# Altium project zx_revo_a3.PrjPcb (part 1 of 3)
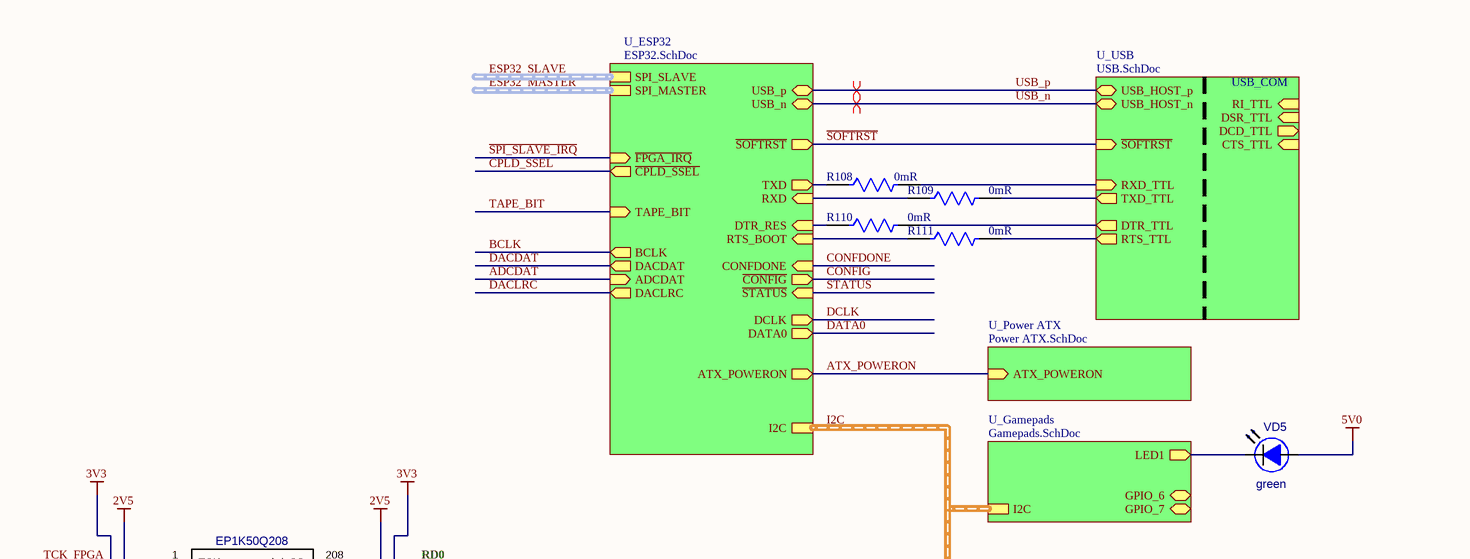
[diagram p0: FPGA.SchDoc, top]
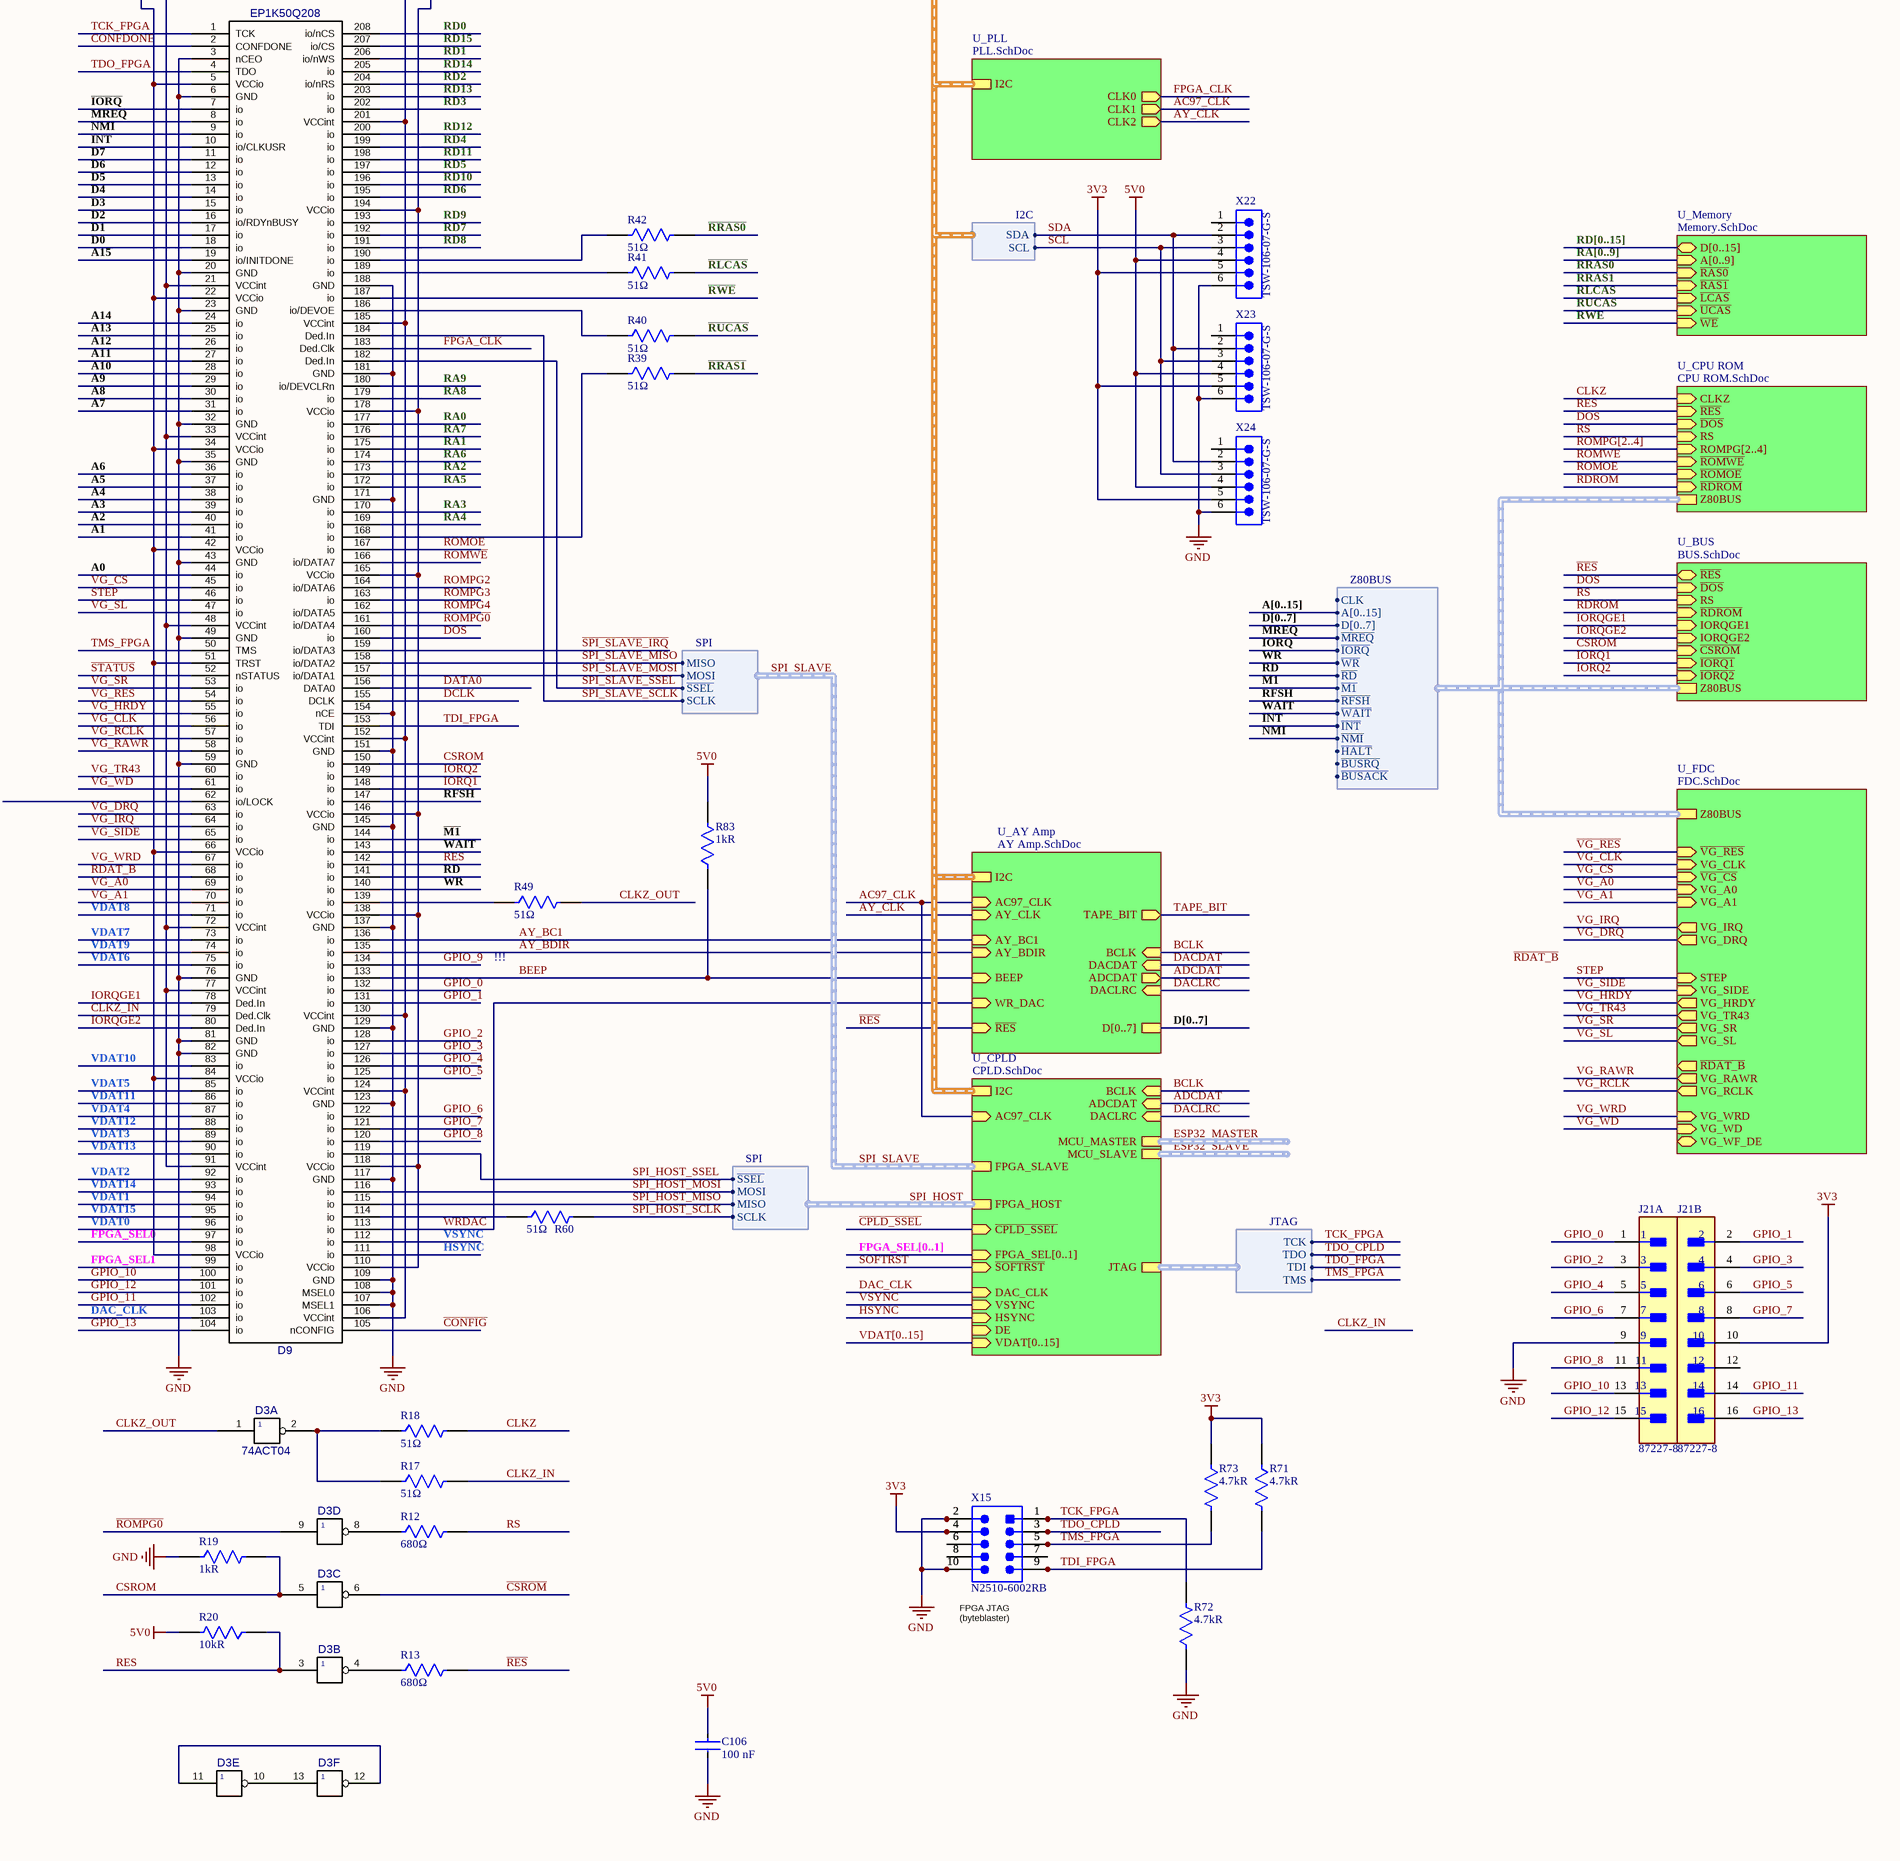
[diagram p1: FPGA.SchDoc, bottom]
13 sheets, 288 parts. Net scope: hierarchical (ports join the sheet entries above them; power ports are global).
Board file: RevA3.PcbDoc
Sheets:
  FPGA.SchDoc
    U_CPU ROM = CPU ROM.SchDoc
    U_BUS = BUS.SchDoc
    U_FDC = FDC.SchDoc
    U_CPLD = CPLD.SchDoc
      U_Video out = Video out.SchDoc
      U_SDCARD = SDCARD.SchDoc
    U_Power ATX = Power ATX.SchDoc
    U_USB = USB.SchDoc
    U_ESP32 = ESP32.SchDoc
    U_AY Amp = AY Amp.SchDoc
      U_Tape = Tape.SchDoc
    U_Gamepads = Gamepads.SchDoc

## Sheet FPGA.SchDoc
size A2 portrait; SheetNumber: 1; SheetTotal: 15

### Parts
C106  Capacitance: 100 nF  [FP-CC0805-0_85-IPC_A]  (hidden comment: CC0805KRX7R9BB104)
D3  value 74ACT04  [SO14]  (hidden comment: 04)  (parts A,B,C,D,E,F of 6)
D9  EP1K50Q208  [PQFP208X5]
J21  87227-8  [FP-87227-8-MFG]  (parts A,B of 2)
R12  value 680Ω  [FP-RT0805-IPC_A]  (hidden comment: RT0805FRE07680RL)
R13  value 680Ω  [FP-RT0805-IPC_A]  (hidden comment: RT0805FRE07680RL)
R17  Resistance: 51Ω  [FP-RR1220-IPC_A]  (hidden comment: RR1220Q-510-D)
R18  Resistance: 51Ω  [FP-RR1220-IPC_A]  (hidden comment: RR1220Q-510-D)
R19  Resistance: 1kR  [FP-CRCW0805-HPe3-IPC_A]  (hidden comment: CRCW08051K00FKEAHP)
R20  Resistance: 10kR  [FP-CR0805-IPC_A]  (hidden comment: CR0805-JW-103ELF)
R39  Resistance: 51Ω  [FP-RR1220-IPC_A]  (hidden comment: RR1220Q-510-D)
R40  Resistance: 51Ω  [FP-RR1220-IPC_A]  (hidden comment: RR1220Q-510-D)
R41  Resistance: 51Ω  [FP-RR1220-IPC_A]  (hidden comment: RR1220Q-510-D)
R42  Resistance: 51Ω  [FP-RR1220-IPC_A]  (hidden comment: RR1220Q-510-D)
R49  Resistance: 51Ω  [FP-RR1220-IPC_A]  (hidden comment: RR1220Q-510-D)
R60  Resistance: 51Ω  [FP-RR1220-IPC_A]  (hidden comment: RR1220Q-510-D)
R71  Resistance: 4.7kR  [FP-CR0805-IPC_A]  (hidden comment: CR0805-JW-472ELF)
R72  Resistance: 4.7kR  [FP-CR0805-IPC_A]  (hidden comment: CR0805-JW-472ELF)
R73  Resistance: 4.7kR  [FP-CR0805-IPC_A]  (hidden comment: CR0805-JW-472ELF)
R83  Resistance: 1kR  [FP-CRCW0805-HPe3-IPC_A]  (hidden comment: CRCW08051K00FKEAHP)
R108  Resistance: 0mR  [FP-CR0805-IPC_A]  (hidden comment: CR0805-J/-000ELF)
R109  Resistance: 0mR  [FP-CR0805-IPC_A]  (hidden comment: CR0805-J/-000ELF)
R110  Resistance: 0mR  [FP-CR0805-IPC_A]  (hidden comment: CR0805-J/-000ELF)
R111  Resistance: 0mR  [FP-CR0805-IPC_A]  (hidden comment: CR0805-J/-000ELF)
VD5  value green  [LED100_LED(Primary)]  (hidden comment: LED)
X15  N2510-6002RB  [3M-N2510-6002-10_V]
X22  TSW-106-07-G-S  [SMTC-TSW-106-07-X-S]
X23  TSW-106-07-G-S  [SMTC-TSW-106-07-X-S]
X24  TSW-106-07-G-S  [SMTC-TSW-106-07-X-S]

### Sub-sheets
U_AY Amp = AY Amp.SchDoc: AY_BC1 (in), ~{RES} (in), AY_CLK (in), AY_BDIR (in), I2C (harness I2C), DACDAT (in), TAPE_BIT (out), ADCDAT (out), BCLK (in), BEEP (in), DACLRC (in), WR_DAC (in), D[0..7], AC97_CLK (in)
U_BUS = BUS.SchDoc: ~{RES} (bidir), ~{DOS} (in), RS (in), ~{RDROM} (in), IORQGE1 (in), IORQGE2 (in), ~{CSROM} (in), ~{IORQ1} (in), ~{IORQ2} (in), Z80BUS (harness Z80BUS)
U_CPLD = CPLD.SchDoc: VDAT[0..15] (in), VSYNC (in), HSYNC (in), DAC_CLK (in), FPGA_HOST (harness SPI), FPGA_SLAVE (harness SPI), MCU_MASTER (harness SPI), MCU_SLAVE (harness SPI), FPGA_SEL[0..1] (in), JTAG (harness JTAG), ~{SOFTRST} (in), ~{CPLD_SSEL} (in), DACLRC (in), AC97_CLK (in), BCLK (in), ADCDAT (in), DE (in), I2C (harness I2C)
U_CPU ROM = CPU ROM.SchDoc: CLKZ (in), ~{RES} (in), ~{DOS} (in), RS (in), ROMPG[2..4] (in), ~{ROMWE} (in), ~{ROMOE} (in), ~{RDROM} (in), Z80BUS (harness Z80BUS)
U_ESP32 = ESP32.SchDoc: SPI_SLAVE (harness SPI), TXD (out), RXD (in), DTR_RES (in), RTS_BOOT (in), I2C (harness I2C), TAPE_BIT (in), USB_n (bidir), USB_p (bidir), SPI_MASTER (harness SPI), ~{SOFTRST} (out), ATX_POWERON (out), ~{FPGA_IRQ} (in), DCLK (out), DATA0 (out), ~{STATUS} (in), CONFDONE (in), ~{CONFIG} (out), ~{CPLD_SSEL} (out), DACLRC (out), ADCDAT (in), BCLK (out), DACDAT (out)
U_FDC = FDC.SchDoc: VG_CLK (in), VG_IRQ (out), VG_DRQ (out), ~{VG_CS} (in), VG_SIDE (in), STEP (in), VG_A0 (in), VG_A1 (in), VG_TR43 (out), VG_SR (out), VG_SL (out), VG_WD (in), VG_WRD (in), VG_WF_DE (bidir), VG_RAWR (out), VG_RCLK (out), ~{VG_RES} (in), VG_HRDY (out), Z80BUS (harness Z80BUS), ~{RDAT_B} (out)
U_Gamepads = Gamepads.SchDoc: GPIO_7 (bidir), LED1 (out), GPIO_6 (bidir), I2C (harness I2C)
U_Memory = Memory.SchDoc (file not in this document): D[0..15] (bidir), A[0..9] (in), ~{RAS0} (in), ~{RAS1} (in), ~{LCAS} (in), ~{UCAS} (in), ~{WE} (in)
U_PLL = PLL.SchDoc (file not in this document): CLK0 (out), CLK1 (out), CLK2 (out), I2C (harness I2C)
U_Power ATX = Power ATX.SchDoc: ATX_POWERON (in)
U_USB = USB.SchDoc: RXD_TTL (in), USB_HOST_p (bidir), TXD_TTL (out), RTS_TTL (out), CTS_TTL (in), DCD_TTL (out), DSR_TTL (in), USB_HOST_n (bidir), RI_TTL (in), DTR_TTL (out), ~{SOFTRST} (in)

### Harnesses
SPI: ~{SSEL}, SCLK, MOSI, MISO
JTAG: TCK, TDO, TDI, TMS
I2C: SDA, SCL
Z80BUS: A[0..15], D[0..7], ~{MREQ}, ~{IORQ}, ~{WR}, ~{RD}, ~{M1}, ~{RFSH}, ~{WAIT}, ~{INT}, ~{NMI}, ~{HALT}, ~{BUSRQ}, ~{BUSACK}, CLK

### Nets
2V5: D9.21(VCCint) D9.33(VCCint) D9.48(VCCint) D9.72(VCCint) D9.77(VCCint) D9.91(VCCint) D9.106(VCCint) D9.124(VCCint) D9.130(VCCint) D9.152(VCCint) D9.185(VCCint) D9.201(VCCint)
3V3: D9.5(VCCio) D9.22(VCCio) D9.34(VCCio) D9.42(VCCio) D9.51(TRST) D9.66(VCCio) D9.84(VCCio) D9.98(VCCio) D9.110(VCCio) D9.118(VCCio) D9.138(VCCio) D9.146(VCCio) D9.165(VCCio) D9.178(VCCio) D9.194(VCCio) J21.10 R71.1 R73.1 X15.4 X22.5 X23.5 X24.5
5V0: C106.1 R20.2 R83.2 VD5.A X22.4 X23.4 X24.4
GND: C106.2 D3.7(GND) D9.3(nCEO) D9.6(GND) D9.20(GND) D9.23(GND) D9.32(GND) D9.35(GND) D9.43(GND) D9.49(GND) D9.59(GND) D9.76(GND) D9.81(GND) D9.82(GND) D9.107(MSEL1) D9.108(MSEL0) D9.109(GND) D9.117(GND) D9.123(GND) D9.129(GND) D9.137(GND) D9.145(GND) D9.151(GND) D9.154(nCE) D9.171(GND) D9.181(GND) D9.188(GND) J21.9 R19.1 R72.1 X15.2 X15.10 X22.6 X23.6 X24.6
VCC5: D3.14(+5v)
A0: D9.44(io)
A1: D9.41(io)
A2: D9.40(io)
A3: D9.39(io)
A4: D9.38(io)
A5: D9.37(io)
A6: D9.36(io)
A7: D9.31(io)
A8: D9.30(io)
A9: D9.29(io)
A10: D9.28(io)
A11: D9.27(io)
A12: D9.26(io)
A13: D9.25(io)
A14: D9.24(io)
A15: D9.19(io/INITDONE)
AC97_CLK: sheet U_CPLD/AC97_CLK, sheet U_AY Amp/AC97_CLK, sheet U_PLL/CLK1
ADCDAT: sheet U_CPLD/ADCDAT, sheet U_ESP32/ADCDAT, sheet U_AY Amp/ADCDAT
ATX_POWERON: sheet U_Power ATX/ATX_POWERON, sheet U_ESP32/ATX_POWERON
AY_BC1: D9.136(io) ; sheet U_AY Amp/AY_BC1
AY_BDIR: D9.135(io) ; sheet U_AY Amp/AY_BDIR
AY_CLK: sheet U_AY Amp/AY_CLK, sheet U_PLL/CLK2
BCLK: sheet U_CPLD/BCLK, sheet U_ESP32/BCLK, sheet U_AY Amp/BCLK
BEEP: D9.133(io) R83.1 ; sheet U_AY Amp/BEEP
~{CONFIG}: D9.105(nCONFIG) ; sheet U_ESP32/~{CONFIG}
~{CPLD_SSEL}: sheet U_CPLD/~{CPLD_SSEL}, sheet U_ESP32/~{CPLD_SSEL}
~{CSROM}: D3.6 ; sheet U_BUS/~{CSROM}
CLKZ: R18.2 ; sheet U_CPU ROM/CLKZ
CLKZ_IN: D9.79(Ded.Clk) R17.2  [project net CLKZ_IN_1]
CLKZ_OUT: D3.1 R49.2  [project net CLKZ_OUT_1]
CONFDONE: D9.2(CONFDONE) ; sheet U_ESP32/CONFDONE
CSROM: D3.5 D9.150(io) R19.2  [project net CSROM_1]
D0: D9.18(io)
D1: D9.17(io)
D2: D9.16(io/RDYnBUSY)
D3: D9.15(io)
D4: D9.14(io)
D5: D9.13(io)
D6: D9.12(io)
D7: D9.11(io)
~{DOS}: D9.160(io) ; sheet U_CPU ROM/~{DOS}, sheet U_BUS/~{DOS}
DAC_CLK: D9.103(io) ; sheet U_CPLD/DAC_CLK
DACDAT: sheet U_ESP32/DACDAT, sheet U_AY Amp/DACDAT
DACLRC: sheet U_CPLD/DACLRC, sheet U_ESP32/DACLRC, sheet U_AY Amp/DACLRC
DATA0: D9.156(DATA0) ; sheet U_ESP32/DATA0
DCLK: D9.155(DCLK) ; sheet U_ESP32/DCLK
DTR: R110.1 ; sheet U_ESP32/DTR_RES
DTR_TTL: R110.2 ; sheet U_USB/DTR_TTL
ESP32_RXD: R109.1 ; sheet U_ESP32/RXD
ESP32_TXD: R108.1 ; sheet U_ESP32/TXD
FPGA_CLK: D9.183(Ded.Clk) ; sheet U_PLL/CLK0
FPGA_SEL0: D9.97(io)
FPGA_SEL1: D9.99(io)
GPIO_0: D9.132(io) J21.1  [project net GPIO_0_1]
GPIO_1: D9.131(io) J21.2  [project net GPIO_1_1]
GPIO_2: D9.128(io) J21.3  [project net GPIO_2_1]
GPIO_3: D9.127(io) J21.4  [project net GPIO_3_1]
GPIO_4: D9.126(io) J21.5  [project net GPIO_4_1]
GPIO_5: D9.125(io) J21.6  [project net GPIO_5_1]
GPIO_6: D9.122(io) J21.7  [project net GPIO_6_1]
GPIO_7: D9.121(io) J21.8  [project net GPIO_7_1]
GPIO_8: D9.120(io) J21.11  [project net GPIO_8_1]
GPIO_9: D9.134(io)  [project net GPIO_9_1]
GPIO_10: D9.100(io) J21.13  [project net GPIO_10_1]
GPIO_11: D9.102(io) J21.14  [project net GPIO_11_1]
GPIO_12: D9.101(io) J21.15  [project net GPIO_12_1]
GPIO_13: D9.104(io) J21.16  [project net GPIO_13_1]
HSYNC: D9.111(io) ; sheet U_CPLD/HSYNC
~{INT}: D9.10(io/CLKUSR) ; sheet U_CPU ROM/Z80BUS.~{INT}
~{IORQ}: D9.7(io) ; sheet U_CPU ROM/Z80BUS.~{IORQ}
~{IORQ1}: D9.148(io) ; sheet U_BUS/~{IORQ1}
~{IORQ2}: D9.149(io) ; sheet U_BUS/~{IORQ2}
IORQGE1: D9.78(Ded.In) ; sheet U_BUS/IORQGE1
IORQGE2: D9.80(Ded.In) ; sheet U_BUS/IORQGE2
~{M1}: D9.144(io) ; sheet U_CPU ROM/Z80BUS.~{M1}
~{MREQ}: D9.8(io) ; sheet U_CPU ROM/Z80BUS.~{MREQ}
~{NMI}: D9.9(io) ; sheet U_CPU ROM/Z80BUS.~{NMI}
~{RD}: D9.141(io) ; sheet U_CPU ROM/Z80BUS.~{RD}
~{RDAT_B}: D9.68(io)  [project net ~{RDAT_B}_1]
~{RDROM}: sheet U_CPU ROM/~{RDROM}, sheet U_BUS/~{RDROM}
~{RES}: R13.2 ; sheet U_CPU ROM/~{RES}, sheet U_BUS/~{RES}, sheet U_AY Amp/~{RES}
~{RFSH}: D9.147(io) ; sheet U_CPU ROM/Z80BUS.~{RFSH}
~{RLCAS}: R41.2 ; sheet U_Memory/~{LCAS}
~{ROMOE}: D9.167(io) ; sheet U_CPU ROM/~{ROMOE}
~{ROMPG0}: D3.9 D9.161(io/DATA4)  [project net ~{ROMPG0}_1]
~{ROMWE}: D9.166(io/DATA7) ; sheet U_CPU ROM/~{ROMWE}
~{RRAS0}: R42.2 ; sheet U_Memory/~{RAS0}
~{RRAS1}: R39.2 ; sheet U_Memory/~{RAS1}
~{RUCAS}: R40.2 ; sheet U_Memory/~{UCAS}
~{RWE}: D9.187(io) ; sheet U_Memory/~{WE}
RA0: D9.177(io)  [project net RA0_1]
RA1: D9.175(io)  [project net RA1_1]
RA2: D9.173(io)  [project net RA2_1]
RA3: D9.170(io)  [project net RA3_1]
RA4: D9.169(io)  [project net RA4_1]
RA5: D9.172(io)  [project net RA5_1]
RA6: D9.174(io)  [project net RA6_1]
RA7: D9.176(io)  [project net RA7_1]
RA8: D9.179(io)  [project net RA8_1]
RA9: D9.180(io/DEVCLRn)  [project net RA9_1]
RD0: D9.208(io/nCS)  [project net RD0_1]
RD1: D9.206(io/nWS)  [project net RD1_1]
RD2: D9.204(io/nRS)  [project net RD2_1]
RD3: D9.202(io)  [project net RD3_1]
RD4: D9.199(io)  [project net RD4_1]
RD5: D9.197(io)  [project net RD5_1]
RD6: D9.195(io)  [project net RD6_1]
RD7: D9.192(io)  [project net RD7_1]
RD8: D9.191(io)  [project net RD8_1]
RD9: D9.193(io)  [project net RD9_1]
RD10: D9.196(io)  [project net RD10_1]
RD11: D9.198(io)  [project net RD11_1]
RD12: D9.200(io)  [project net RD12_1]
RD13: D9.203(io)  [project net RD13_1]
RD14: D9.205(io)  [project net RD14_1]
RD15: D9.207(io/CS)  [project net RD15_1]
RES: D3.3 D9.142(io) R20.1  [project net RES_1]
ROMPG2: D9.164(io/DATA6)
ROMPG3: D9.163(io)
ROMPG4: D9.162(io/DATA5)
RS: R12.2 ; sheet U_CPU ROM/RS, sheet U_BUS/RS
RTS: R111.1 ; sheet U_ESP32/RTS_BOOT
RTS_TTL: R111.2 ; sheet U_USB/RTS_TTL
RXD_TTL: R109.2 ; sheet U_USB/TXD_TTL
~{SOFTRST}: sheet U_CPLD/~{SOFTRST}, sheet U_USB/~{SOFTRST}, sheet U_ESP32/~{SOFTRST}
~{SPI_SLAVE_IRQ}: D9.159(io/DATA3) ; sheet U_ESP32/~{FPGA_IRQ}
~{SPI_SLAVE_SSEL}: D9.182(Ded.In) ; sheet U_CPLD/FPGA_SLAVE.~{SSEL}
~{STATUS}: D9.52(nSTATUS) ; sheet U_ESP32/~{STATUS}
SCL: X22.3 X23.3 X24.3 ; sheet U_CPLD/I2C.SCL  [project net I2C.SCL]
SDA: X22.2 X23.2 X24.2 ; sheet U_CPLD/I2C.SDA  [project net I2C.SDA]
SPI_HOST_MISO: D9.115(io) ; sheet U_CPLD/FPGA_HOST.MISO  [project net SPI_HOST.MISO]
SPI_HOST_MOSI: D9.116(io) ; sheet U_CPLD/FPGA_HOST.MOSI  [project net SPI_HOST.MOSI]
SPI_HOST_SCLK: R60.2 ; sheet U_CPLD/FPGA_HOST.SCLK  [project net SPI_HOST.SCLK]
SPI_HOST_SSEL: D9.119(io) ; sheet U_CPLD/FPGA_HOST.~{SSEL}  [project net SPI_HOST.~{SSEL}]
SPI_SLAVE_MISO: D9.158(io/DATA2) ; sheet U_CPLD/FPGA_SLAVE.MISO  [project net SPI_SLAVE.MISO]
SPI_SLAVE_MOSI: D9.157(io/DATA1) ; sheet U_CPLD/FPGA_SLAVE.MOSI  [project net SPI_SLAVE.MOSI]
SPI_SLAVE_SCLK: D9.184(Ded.In) ; sheet U_CPLD/FPGA_SLAVE.SCLK  [project net SPI_SLAVE.SCLK]
STEP: D9.46(io) ; sheet U_FDC/STEP
TAPE_BIT: sheet U_ESP32/TAPE_BIT, sheet U_AY Amp/TAPE_BIT
TCK_FPGA: D9.1(TCK) R72.2 X15.1 ; sheet U_CPLD/JTAG.TCK
TDI_FPGA: D9.153(TDI) R71.2 X15.9  [project net TDI_FPGA_1]
TDO_CPLD: X15.3 ; sheet U_CPLD/JTAG.TDO
TDO_FPGA: D9.4(TDO) ; sheet U_CPLD/JTAG.TDI
TMS_FPGA: D9.50(TMS) R73.2 X15.5 ; sheet U_CPLD/JTAG.TMS
TXD_TTL: R108.2 ; sheet U_USB/RXD_TTL
USB_n: sheet U_USB/USB_HOST_n, sheet U_ESP32/USB_n
USB_p: sheet U_USB/USB_HOST_p, sheet U_ESP32/USB_p
~{VG_CS}: D9.45(io) ; sheet U_FDC/~{VG_CS}
~{VG_RES}: D9.54(io) ; sheet U_FDC/~{VG_RES}
VDAT0: D9.96(io)
VDAT1: D9.94(io)
VDAT2: D9.92(io)
VDAT3: D9.89(io)
VDAT4: D9.87(io)
VDAT5: D9.85(io)
VDAT6: D9.75(io)
VDAT7: D9.73(io)
VDAT8: D9.71(io)
VDAT9: D9.74(io)
VDAT10: D9.83(io)
VDAT11: D9.86(io)
VDAT12: D9.88(io)
VDAT13: D9.90(io)
VDAT14: D9.93(io)
VDAT15: D9.95(io)
VG_A0: D9.69(io) ; sheet U_FDC/VG_A0
VG_A1: D9.70(io) ; sheet U_FDC/VG_A1
VG_CLK: D9.56(io) ; sheet U_FDC/VG_CLK
VG_DRQ: D9.63(io) ; sheet U_FDC/VG_DRQ
VG_HRDY: D9.55(io) ; sheet U_FDC/VG_HRDY
VG_IRQ: D9.64(io) ; sheet U_FDC/VG_IRQ
VG_RAWR: D9.58(io) ; sheet U_FDC/VG_RAWR
VG_RCLK: D9.57(io) ; sheet U_FDC/VG_RCLK
VG_SIDE: D9.65(io) ; sheet U_FDC/VG_SIDE
VG_SL: D9.47(io) ; sheet U_FDC/VG_SL
VG_SR: D9.53(io) ; sheet U_FDC/VG_SR
VG_TR43: D9.60(io) ; sheet U_FDC/VG_TR43
VG_WD: D9.61(io) ; sheet U_FDC/VG_WD
VG_WRD: D9.67(io) ; sheet U_FDC/VG_WRD
VSYNC: D9.112(io) ; sheet U_CPLD/VSYNC
~{WAIT}: D9.143(io) ; sheet U_CPU ROM/Z80BUS.~{WAIT}
~{WR}: D9.140(io) ; sheet U_CPU ROM/Z80BUS.~{WR}
WRDAC: D9.113(io) ; sheet U_AY Amp/WR_DAC
NetD3_2: D3.2 R17.1 R18.1
NetD3_4: D3.4 R13.1
NetD3_8: D3.8 R12.1
NetD3_10: D3.10 D3.13
NetD3_11: D3.11 D3.12
NetD9_114: D9.114(io) R60.1
NetD9_139: D9.139(io) R49.1
NetD9_168: D9.168(io) R39.1
NetD9_186: D9.186(io/DEVOE) R40.1
NetD9_189: D9.189(io) R41.1
NetD9_190: D9.190(io) R42.1
NetR74_2: VD5.K ; sheet U_Gamepads/LED1

Not connected (* = marked no-connect by the designer): D9 62(io/LOCK); J21 12; X15 6 7 8; X22 1; X23 1; X24 1

### Buses and harness runs
bus A[0..15]
bus D[0..7]
bus D[0..7] = sheet U_AY Amp/D[0..7]
bus FPGA_SEL[0..1] = sheet U_CPLD/FPGA_SEL[0..1]
bus RA[0..9] = sheet U_Memory/A[0..9]
bus RD[0..15] = sheet U_Memory/D[0..15]
bus ROMPG[2..4] = sheet U_CPU ROM/ROMPG[2..4]
bus VDAT[0..15] = sheet U_CPLD/VDAT[0..15]
harness ESP32_MASTER = sheet U_CPLD/MCU_MASTER
harness ESP32_MASTER = sheet U_ESP32/SPI_MASTER
harness ESP32_SLAVE = sheet U_CPLD/MCU_SLAVE
harness ESP32_SLAVE = sheet U_ESP32/SPI_SLAVE
harness I2C = sheet U_AY Amp/I2C = sheet U_CPLD/I2C = sheet U_ESP32/I2C = sheet U_Gamepads/I2C = sheet U_PLL/I2C
harness sheet U_BUS/Z80BUS = sheet U_CPU ROM/Z80BUS = sheet U_FDC/Z80BUS
harness SPI_HOST = sheet U_CPLD/FPGA_HOST
harness SPI_SLAVE = sheet U_CPLD/FPGA_SLAVE

### Layout directives
differential pair: USB_n, USB_p

### Notes on the sheet
- USB_COM
- !!!
- (near X15) FPGA JTAG
  (byteblaster)
- Labels drawn without touching a wire or pin: ~{RDAT_B}

### Library data of the parts
C106 = CMP-2100-03606-3: CAP CER 0.1UF 50V X7R 0805; Manufacturer: Yageo; Value: 100 nF; Manufacturer Part Number: CC0805KRX7R9BB104; Category: Cap; Case/Package: 0805
J21 = CMP-03369-000064-1: CONN HEADER VERT 16POS 2.54MM; Manufacturer: TE Connectivity; value: HEADER 16POS 2.54MM 2ROW; Pitch: 2.54mm; Manufacturer Part Number: 87227-8; Category: Connector; Case/Package: PLD-16
R12 R13 = CMP-03412-000082-1: RES SMD 680 OHM 1% 1/8W 0805; Manufacturer: Yageo; Category: Res; Manufacturer Part Number: RT0805FRE07680RL; Resistance: 680Ω; Case/Package: 0805
R17 R18 R39-R42 R49 R60 = CMP-2001-03561-2: 51Ω ±0.5% 0.1W 1/10W Chip Resistor 0805 (2012 Metric) Thin Film; Manufacturer: Susumu; Case/Package: 0805; Number of Terminations: 2; Termination: SMD/SMT; Number of Pins: 2; Manufacturer Part Number: RR1220Q-510-D; value: 51Ω; Category: Res
R19 R83 = CMP-02407-004529-1: RES Thick Film, 1kΩ, 1%, 0.5W, 100ppm/°C, 0805; Manufacturer: Vishay Dale; Case/Package: 0805; Number of Pins: 2; Termination: Solder; Manufacturer Part Number: CRCW08051K00FKEAHP; value: 1kΩ; Category: Res
R20 = CMP-07231-003873-1: Thick Film Chip Resistors 0805 10kΩ 0.125W 5% 200ppm/°C; Manufacturer: Bourns; value: 10kΩ; Manufacturer Part Number: CR0805-JW-103ELF; Number of Terminations: 2; Termination: SMD/SMT; Number of Pins: 2; Case/Package: 0805; Category: Res
R71-R73 = CMP-07231-004713-1: Thick Film Chip Resistors 0805 4.7kΩ 0.125W 5% 200ppm/°C; Manufacturer: Bourns; Case/Package: 0805; Number of Terminations: 2; Termination: SMD/SMT; Manufacturer Part Number: CR0805-JW-472ELF; value: 4.7kΩ; Category: Res
R108-R111 = CMP-07231-004348-1: Thick Film Chip Resistors 0805 0Ω 0.125W 5%; Manufacturer: Bourns; Case/Package: 0805; Number of Pins: 2; Termination: SMD/SMT; Manufacturer Part Number: CR0805-J/-000ELF; value: 0Ω; Category: Res
VD5 = LED: Light Emitting Diode; Category: Diode
X15 = CMP-2000-06794-1: Male Header, Pitch 2.54 mm, 2 x 5 Postion, Height 9.91 mm, Tail Length 2.84 mm, -55 to 105 degC, RoHS, Bulk; PartNumber: N2510; Manufacturer: 3M; Pitch: 2.54mm; value: 10-Pin Shrouded Header, 2.54mm; Manufacturer Part Number: N2510-6002RB; Case/Package: IDC-10; Category: Connector
X22-X24 = CMP-1024-00383-1: 0.025" SQ Post Header, Through-hole, Vertical, -55 to 125 degC, 2.54 mm Pitch, 6-Pin, Male, RoHS; Manufacturer: Samtec; Pitch: 2.54 mm; value: 6 pin header 2.54mm; PackageDescription: .025[0.64] SQ. Post Terminal Strip Assembly; PartNumber: TSW-106-07-G-S; Manufacturer Part Number: TSW-106-07-G-S; Case/Package: PLS-6; Category: Connector
D3 = 04: Case/Package: SOIC-14; Category: IC
D9 = EP1K50Q208: Value: EP1K50Q208; Case/Package: PQFP-208; Category: IC

## Sheet CPU ROM.SchDoc
size A4; SheetNumber: 9; SheetTotal: 15
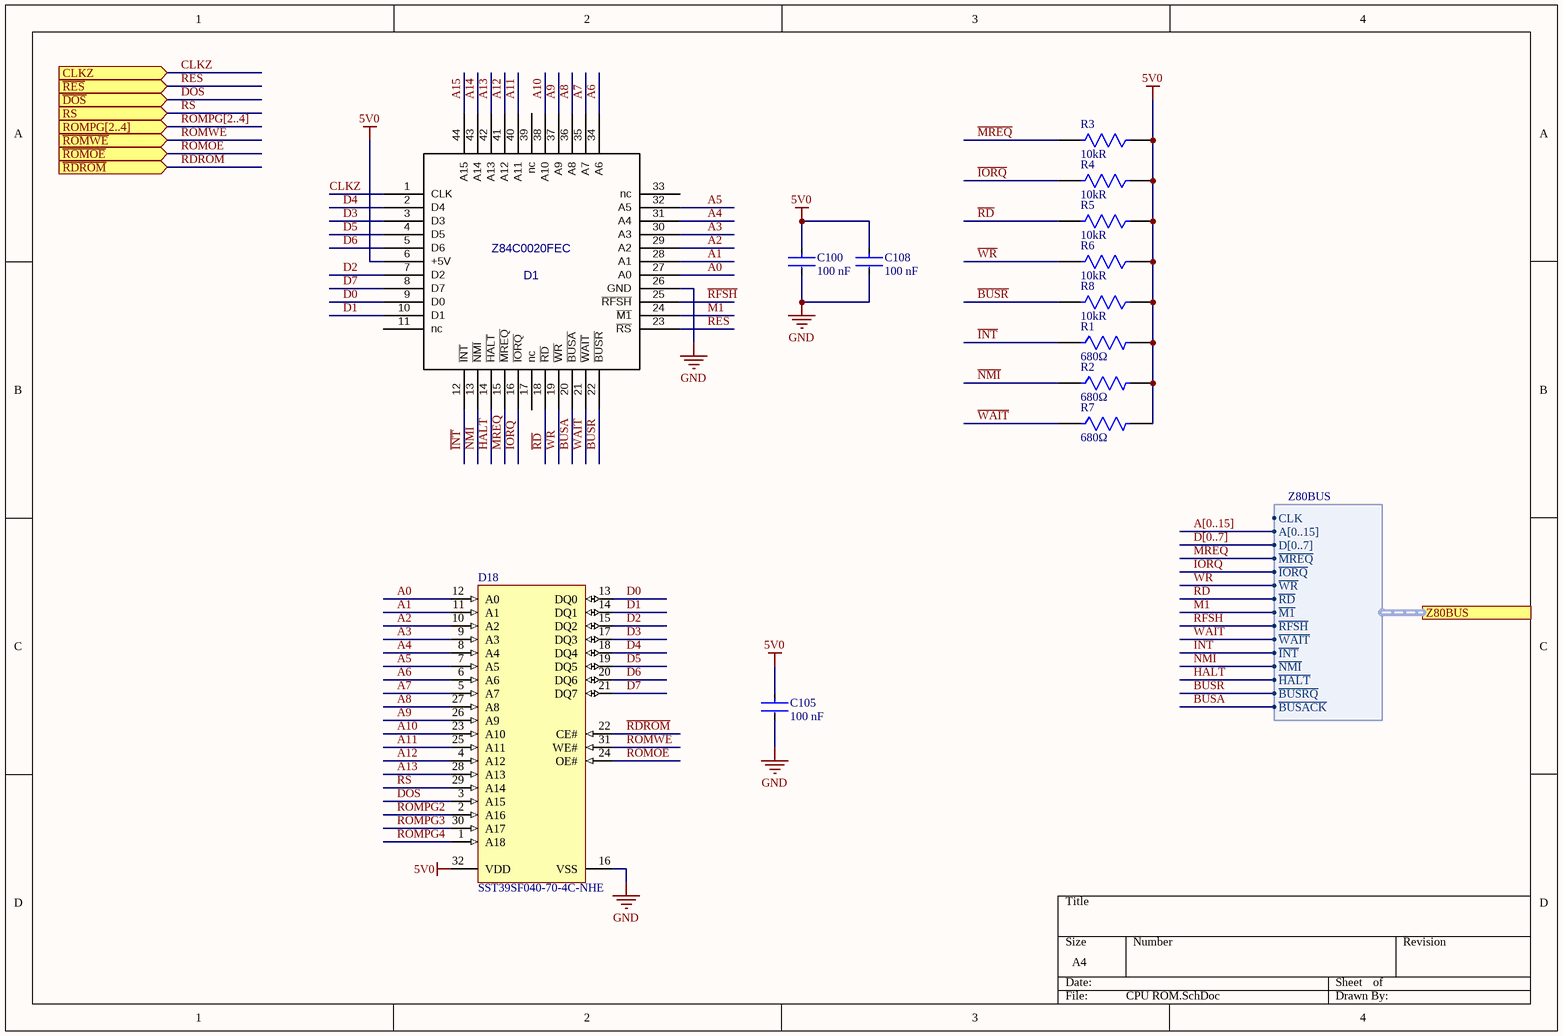
[diagram p2: CPU ROM.SchDoc]

### Parts
C100  Capacitance: 100 nF  [FP-CC0805-0_85-IPC_A]  (hidden comment: CC0805KRX7R9BB104)
C105  Capacitance: 100 nF  [FP-CC0805-0_85-IPC_A]  (hidden comment: CC0805KRX7R9BB104)
C108  Capacitance: 100 nF  [FP-CC0805-0_85-IPC_A]  (hidden comment: CC0805KRX7R9BB104)
D1  Z84C0020FEC  [QFP44X8]
D18  SST39SF040-70-4C-NHE  [MCHP-PLCC-NH32_L]
R1  value 680Ω  [FP-RT0805-IPC_A]  (hidden comment: RT0805FRE07680RL)
R2  value 680Ω  [FP-RT0805-IPC_A]  (hidden comment: RT0805FRE07680RL)
R3  Resistance: 10kR  [FP-CR0805-IPC_A]  (hidden comment: CR0805-JW-103ELF)
R4  Resistance: 10kR  [FP-CR0805-IPC_A]  (hidden comment: CR0805-JW-103ELF)
R5  Resistance: 10kR  [FP-CR0805-IPC_A]  (hidden comment: CR0805-JW-103ELF)
R6  Resistance: 10kR  [FP-CR0805-IPC_A]  (hidden comment: CR0805-JW-103ELF)
R7  value 680Ω  [FP-RT0805-IPC_A]  (hidden comment: RT0805FRE07680RL)
R8  Resistance: 10kR  [FP-CR0805-IPC_A]  (hidden comment: CR0805-JW-103ELF)

### Ports
CLKZ (in), ROMPG[2..4] (in), RS (in), Z80BUS (harness Z80BUS), ~{DOS} (in), ~{RDROM} (in), ~{RES} (in), ~{ROMOE} (in), ~{ROMWE} (in)

### Harnesses
Z80BUS: A[0..15], D[0..7], ~{MREQ}, ~{IORQ}, ~{WR}, ~{RD}, ~{M1}, ~{RFSH}, ~{WAIT}, ~{INT}, ~{NMI}, ~{HALT}, ~{BUSRQ}, ~{BUSACK}, CLK

### Nets
5V0: C100.1 C105.1 C108.1 D1.6(+5V) D18.32(VDD) R1.2 R2.2 R3.1 R4.1 R5.1 R6.1 R7.2 R8.1
GND: C100.2 C105.2 C108.2 D1.26(GND) D18.16(VSS)
A0: D1.27(A0) D18.12(A0)
A1: D1.28(A1) D18.11(A1)
A2: D1.29(A2) D18.10(A2)
A3: D1.30(A3) D18.9(A3)
A4: D1.31(A4) D18.8(A4)
A5: D1.32(A5) D18.7(A5)
A6: D1.34(A6) D18.6(A6)
A7: D1.35(A7) D18.5(A7)
A8: D1.36(A8) D18.27(A8)
A9: D1.37(A9) D18.26(A9)
A10: D1.38(A10) D18.23(A10)
A11: D1.40(A11) D18.25(A11)
A12: D1.41(A12) D18.4(A12)
A13: D1.42(A13) D18.28(A13)
A14: D1.43(A14)
A15: D1.44(A15)
~{BUSA}: D1.20(~{BUSA}) ; port Z80BUS.~{BUSACK}
~{BUSR}: D1.22(~{BUSR}) R8.2 ; port Z80BUS.~{BUSRQ}
CLKZ: D1.1(CLK) ; port CLKZ
D0: D1.9(D0) D18.13(DQ0)
D1: D1.10(D1) D18.14(DQ1)
D2: D1.7(D2) D18.15(DQ2)
D3: D1.3(D3) D18.17(DQ3)
D4: D1.2(D4) D18.18(DQ4)
D5: D1.4(D5) D18.19(DQ5)
D6: D1.5(D6) D18.20(DQ6)
D7: D1.8(D7) D18.21(DQ7)
~{DOS}: D18.3(A15) ; port ~{DOS}
~{HALT}: D1.14(~{HALT}) ; port Z80BUS.~{HALT}
~{INT}: D1.12(~{INT}) R1.1 ; port Z80BUS.~{INT}
~{IORQ}: D1.16(~{IORQ}) R4.2 ; port Z80BUS.~{IORQ}
~{M1}: D1.24(~{M1}) ; port Z80BUS.~{M1}
~{MREQ}: D1.15(~{MREQ}) R3.2 ; port Z80BUS.~{MREQ}
~{NMI}: D1.13(~{NMI}) R2.1 ; port Z80BUS.~{NMI}
~{RD}: D1.18(~{RD}) R5.2 ; port Z80BUS.~{RD}
~{RDROM}: D18.22(CE#) ; port ~{RDROM}
~{RES}: D1.23(~{RS}) ; port ~{RES}
~{RFSH}: D1.25(~{RFSH}) ; port Z80BUS.~{RFSH}
~{ROMOE}: D18.24(OE#) ; port ~{ROMOE}
~{ROMWE}: D18.31(WE#) ; port ~{ROMWE}
ROMPG2: D18.2(A16)
ROMPG3: D18.30(A17)
ROMPG4: D18.1(A18)
RS: D18.29(A14) ; port RS
~{WAIT}: D1.21(~{WAIT}) R7.1 ; port Z80BUS.~{WAIT}
~{WR}: D1.19(~{WR}) R6.2 ; port Z80BUS.~{WR}

Not connected (* = marked no-connect by the designer): D1 11(nc) 17(nc) 33(nc) 39(nc)

### Buses and harness runs
bus A[0..15]
bus D[0..7]
bus ROMPG[2..4] = port ROMPG[2..4]

### Library data of the parts
C100 C105 C108 = CMP-2100-03606-3: as C106 on sheet FPGA; Manufacturer Part Number: CC0805KRX7R9BB104; Category: Cap; Case/Package: 0805
D18 = CMP-0378-00006-1: 4 Mbit Multi-Purpose Flash, 4.5 to 5.5 V, 1 kHz, 0 to 70 degC, 32-pin PLCC (NH32), Tube; Manufacturer: Microchip; PartNumber: SST39SF040-70-4C-NHE; PackageDescription: 32-lead Plastic Lead Chip Carrier, 11.43 x 13.97 mm Body, 1.27 mm Pitch; Manufacturer Part Number: SST39SF040-70-4C-NHE; value: SST39SF040-70-4C-NHE; Case/Package: PLCC-32; Category: IC
R1 R2 R7 = CMP-03412-000082-1: as R12 on sheet FPGA; Category: Res; Manufacturer Part Number: RT0805FRE07680RL; Resistance: 680Ω; Case/Package: 0805
R3-R6 R8 = CMP-07231-003873-1: as R20 on sheet FPGA; value: 10kΩ; Manufacturer Part Number: CR0805-JW-103ELF; Number of Terminations: 2; Termination: SMD/SMT; Number of Pins: 2; Case/Package: 0805; Category: Res
D1 = Z84C0020FEC: Value: Z84C0020FEC; Case/Package: QFP-44; Category: IC

## Sheet BUS.SchDoc
size A4; SheetNumber: 8; SheetTotal: 15
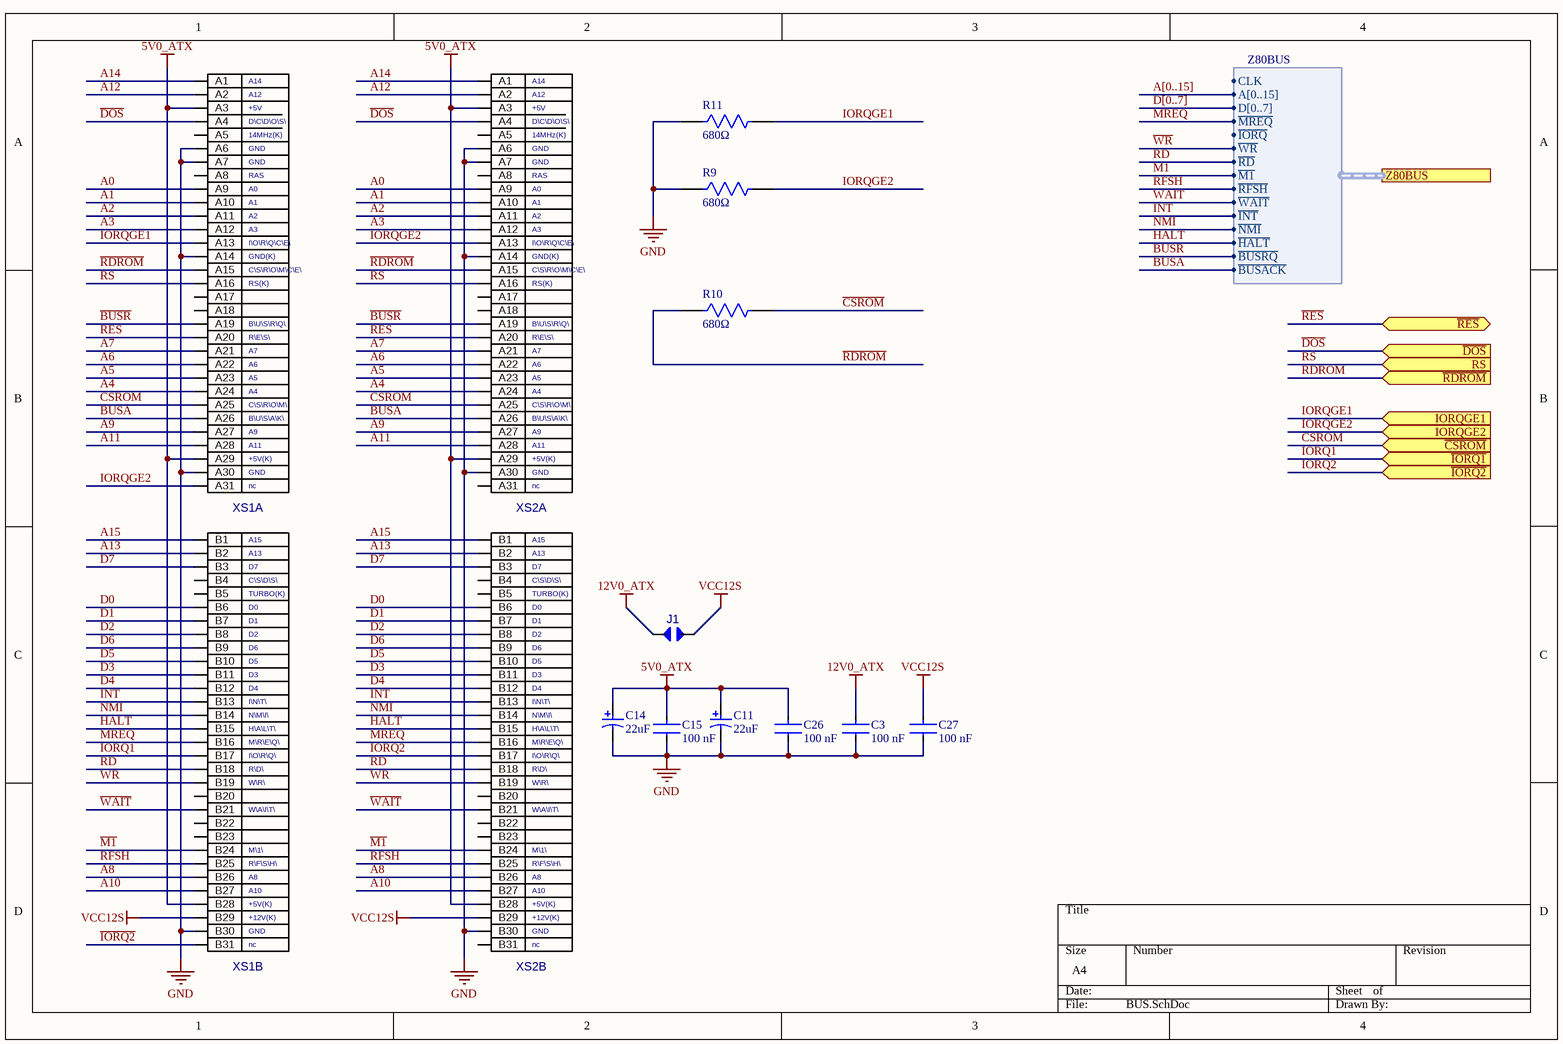
[diagram p3: BUS.SchDoc]

### Parts
C3  Capacitance: 100 nF  [FP-CC0805-0_85-IPC_A]  (hidden comment: CC0805KRX7R9BB104)
C11  Capacitance: 22uF  [AVX-TAJ-B-2_M]  (hidden comment: TAJB226K016RNJ)
C14  Capacitance: 22uF  [AVX-TAJ-B-2_M]  (hidden comment: TAJB226K016RNJ)
C15  Capacitance: 100 nF  [FP-CC0805-0_85-IPC_A]  (hidden comment: CC0805KRX7R9BB104)
C26  Capacitance: 100 nF  [FP-CC0805-0_85-IPC_A]  (hidden comment: CC0805KRX7R9BB104)
C27  Capacitance: 100 nF  [FP-CC0805-0_85-IPC_A]  (hidden comment: CC0805KRX7R9BB104)
J1  JUMPER  [JUMPER_JUMPER(Primary)]  (value not drawn)
R9  value 680Ω  [FP-RT0805-IPC_A]  (hidden comment: RT0805FRE07680RL)
R10  value 680Ω  [FP-RT0805-IPC_A]  (hidden comment: RT0805FRE07680RL)
R11  value 680Ω  [FP-RT0805-IPC_A]  (hidden comment: RT0805FRE07680RL)
XS1  ZXSLOT  [SLOT62_ZXSLOT(Primary)]  (value not drawn)  (parts A,B of 2)
XS2  ZXSLOT  [SLOT62_ZXSLOT(Primary)]  (value not drawn)  (parts A,B of 2)

### Ports
IORQGE1 (in), IORQGE2 (in), RS (in), Z80BUS (harness Z80BUS), ~{CSROM} (in), ~{DOS} (in), ~{IORQ1} (in), ~{IORQ2} (in), ~{RDROM} (in), ~{RES} (bidir)

### Harnesses
Z80BUS: A[0..15], D[0..7], ~{MREQ}, ~{IORQ}, ~{WR}, ~{RD}, ~{M1}, ~{RFSH}, ~{WAIT}, ~{INT}, ~{NMI}, ~{HALT}, ~{BUSRQ}, ~{BUSACK}, CLK

### Nets
5V0_ATX: C11.1 C14.1 C15.1 C26.1 XS1.A3 XS1.A29 XS1.B28 XS2.A3 XS2.A29 XS2.B28
12V0_ATX: C3.1 J1.0
GND: C3.2 C11.2 C14.2 C15.2 C26.2 C27.2 R9.1 R11.1 XS1.A6 XS1.A7 XS1.A14 XS1.A30 XS1.B30 XS2.A6 XS2.A7 XS2.A14 XS2.A30 XS2.B30
VCC12S: C27.1 J1.1 XS1.B29 XS2.B29
A0: XS1.A9 XS2.A9
A1: XS1.A10 XS2.A10
A2: XS1.A11 XS2.A11
A3: XS1.A12 XS2.A12
A4: XS1.A24 XS2.A24
A5: XS1.A23 XS2.A23
A6: XS1.A22 XS2.A22
A7: XS1.A21 XS2.A21
A8: XS1.B26 XS2.B26
A9: XS1.A27 XS2.A27
A10: XS1.B27 XS2.B27
A11: XS1.A28 XS2.A28
A12: XS1.A2 XS2.A2
A13: XS1.B2 XS2.B2
A14: XS1.A1 XS2.A1
A15: XS1.B1 XS2.B1
~{BUSA}: XS1.A26 XS2.A26 ; port Z80BUS.~{BUSACK}
~{BUSR}: XS1.A19 XS2.A19 ; port Z80BUS.~{BUSRQ}
~{CSROM}: R10.2 XS1.A25 XS2.A25 ; port ~{CSROM}
D0: XS1.B6 XS2.B6
D1: XS1.B7 XS2.B7
D2: XS1.B8 XS2.B8
D3: XS1.B11 XS2.B11
D4: XS1.B12 XS2.B12
D5: XS1.B10 XS2.B10
D6: XS1.B9 XS2.B9
D7: XS1.B3 XS2.B3
~{DOS}: XS1.A4 XS2.A4 ; port ~{DOS}
~{HALT}: XS1.B15 XS2.B15 ; port Z80BUS.~{HALT}
~{INT}: XS1.B13 XS2.B13 ; port Z80BUS.~{INT}
~{IORQ1}: XS1.B17 ; port ~{IORQ1}
~{IORQ2}: XS1.B31 XS2.B17 ; port ~{IORQ2}
IORQGE1: R11.2 XS1.A13 ; port IORQGE1
IORQGE2: R9.2 XS1.A31 XS2.A13 ; port IORQGE2
~{M1}: XS1.B24 XS2.B24 ; port Z80BUS.~{M1}
~{MREQ}: XS1.B16 XS2.B16 ; port Z80BUS.~{MREQ}
~{NMI}: XS1.B14 XS2.B14 ; port Z80BUS.~{NMI}
~{RD}: XS1.B18 XS2.B18 ; port Z80BUS.~{RD}
~{RDROM}: R10.1 XS1.A15 XS2.A15 ; port ~{RDROM}
~{RES}: XS1.A20 XS2.A20 ; port ~{RES}
~{RFSH}: XS1.B25 XS2.B25 ; port Z80BUS.~{RFSH}
RS: XS1.A16 XS2.A16 ; port RS
~{WAIT}: XS1.B21 XS2.B21 ; port Z80BUS.~{WAIT}
~{WR}: XS1.B19 XS2.B19 ; port Z80BUS.~{WR}

Not connected (* = marked no-connect by the designer): XS1 A5 A8 A17 A18 B4 B5 B20 B22 B23; XS2 A5 A8 A17 A18 A31 B4 B5 B20 B22 B23 B31

### Buses and harness runs
bus A[0..15]
bus D[0..7]

### Notes on the sheet
- (in symbol ZXSLOT, part A) +5V; D\C\D\O\S\; 14MHz(K); GND; RAS; A0; I\O\R\Q\C\E\; GND(K); C\S\R\O\M\C\E\; RS(K); B\U\S\R\Q\; R\E\S\; C\S\R\O\M\; B\U\S\A\K\; +5V(K); nc
- (in symbol ZXSLOT, part B) D7; C\S\D\S\; TURBO(K); D0; D1; D2; D6; D5; D3; D4; I\N\T\; N\M\I\; H\A\L\T\; M\R\E\Q\; I\O\R\Q\; R\D\; W\R\; W\A\I\T\; M\1\; R\F\S\H\; +5V(K); +12V(K); GND; nc

### Library data of the parts
C3 C15 C26 C27 = CMP-2100-03606-3: as C106 on sheet FPGA; Manufacturer Part Number: CC0805KRX7R9BB104; Category: Cap; Case/Package: 0805
C11 C14 = CMP-2100-03689-1: Standard Tantalum, 22 uF, +/- 10%, 16 V, -55 to 125 degC, 2-Pin SMD (1210), RoHS, Tape and Reel; Manufacturer: Kyocera AVX; value: 22uF; Number of Pins: 2; Termination: SMD/SMT; Case/Package: 1210; Manufacturer Part Number: TAJB226K016RNJ; Category: Cap
J1 = JUMPER: HLT->~IP; Value: PLS-2; Case/Package: PLS-2; Category: Connector
R9-R11 = CMP-03412-000082-1: as R12 on sheet FPGA; Category: Res; Manufacturer Part Number: RT0805FRE07680RL; Resistance: 680Ω; Case/Package: 0805
XS1 XS2 = ZXSLOT: Value: ZXSLOT; Case/Package: SL62; Category: Connector

## Sheet FDC.SchDoc
size A3; SheetNumber: 5; SheetTotal: 15
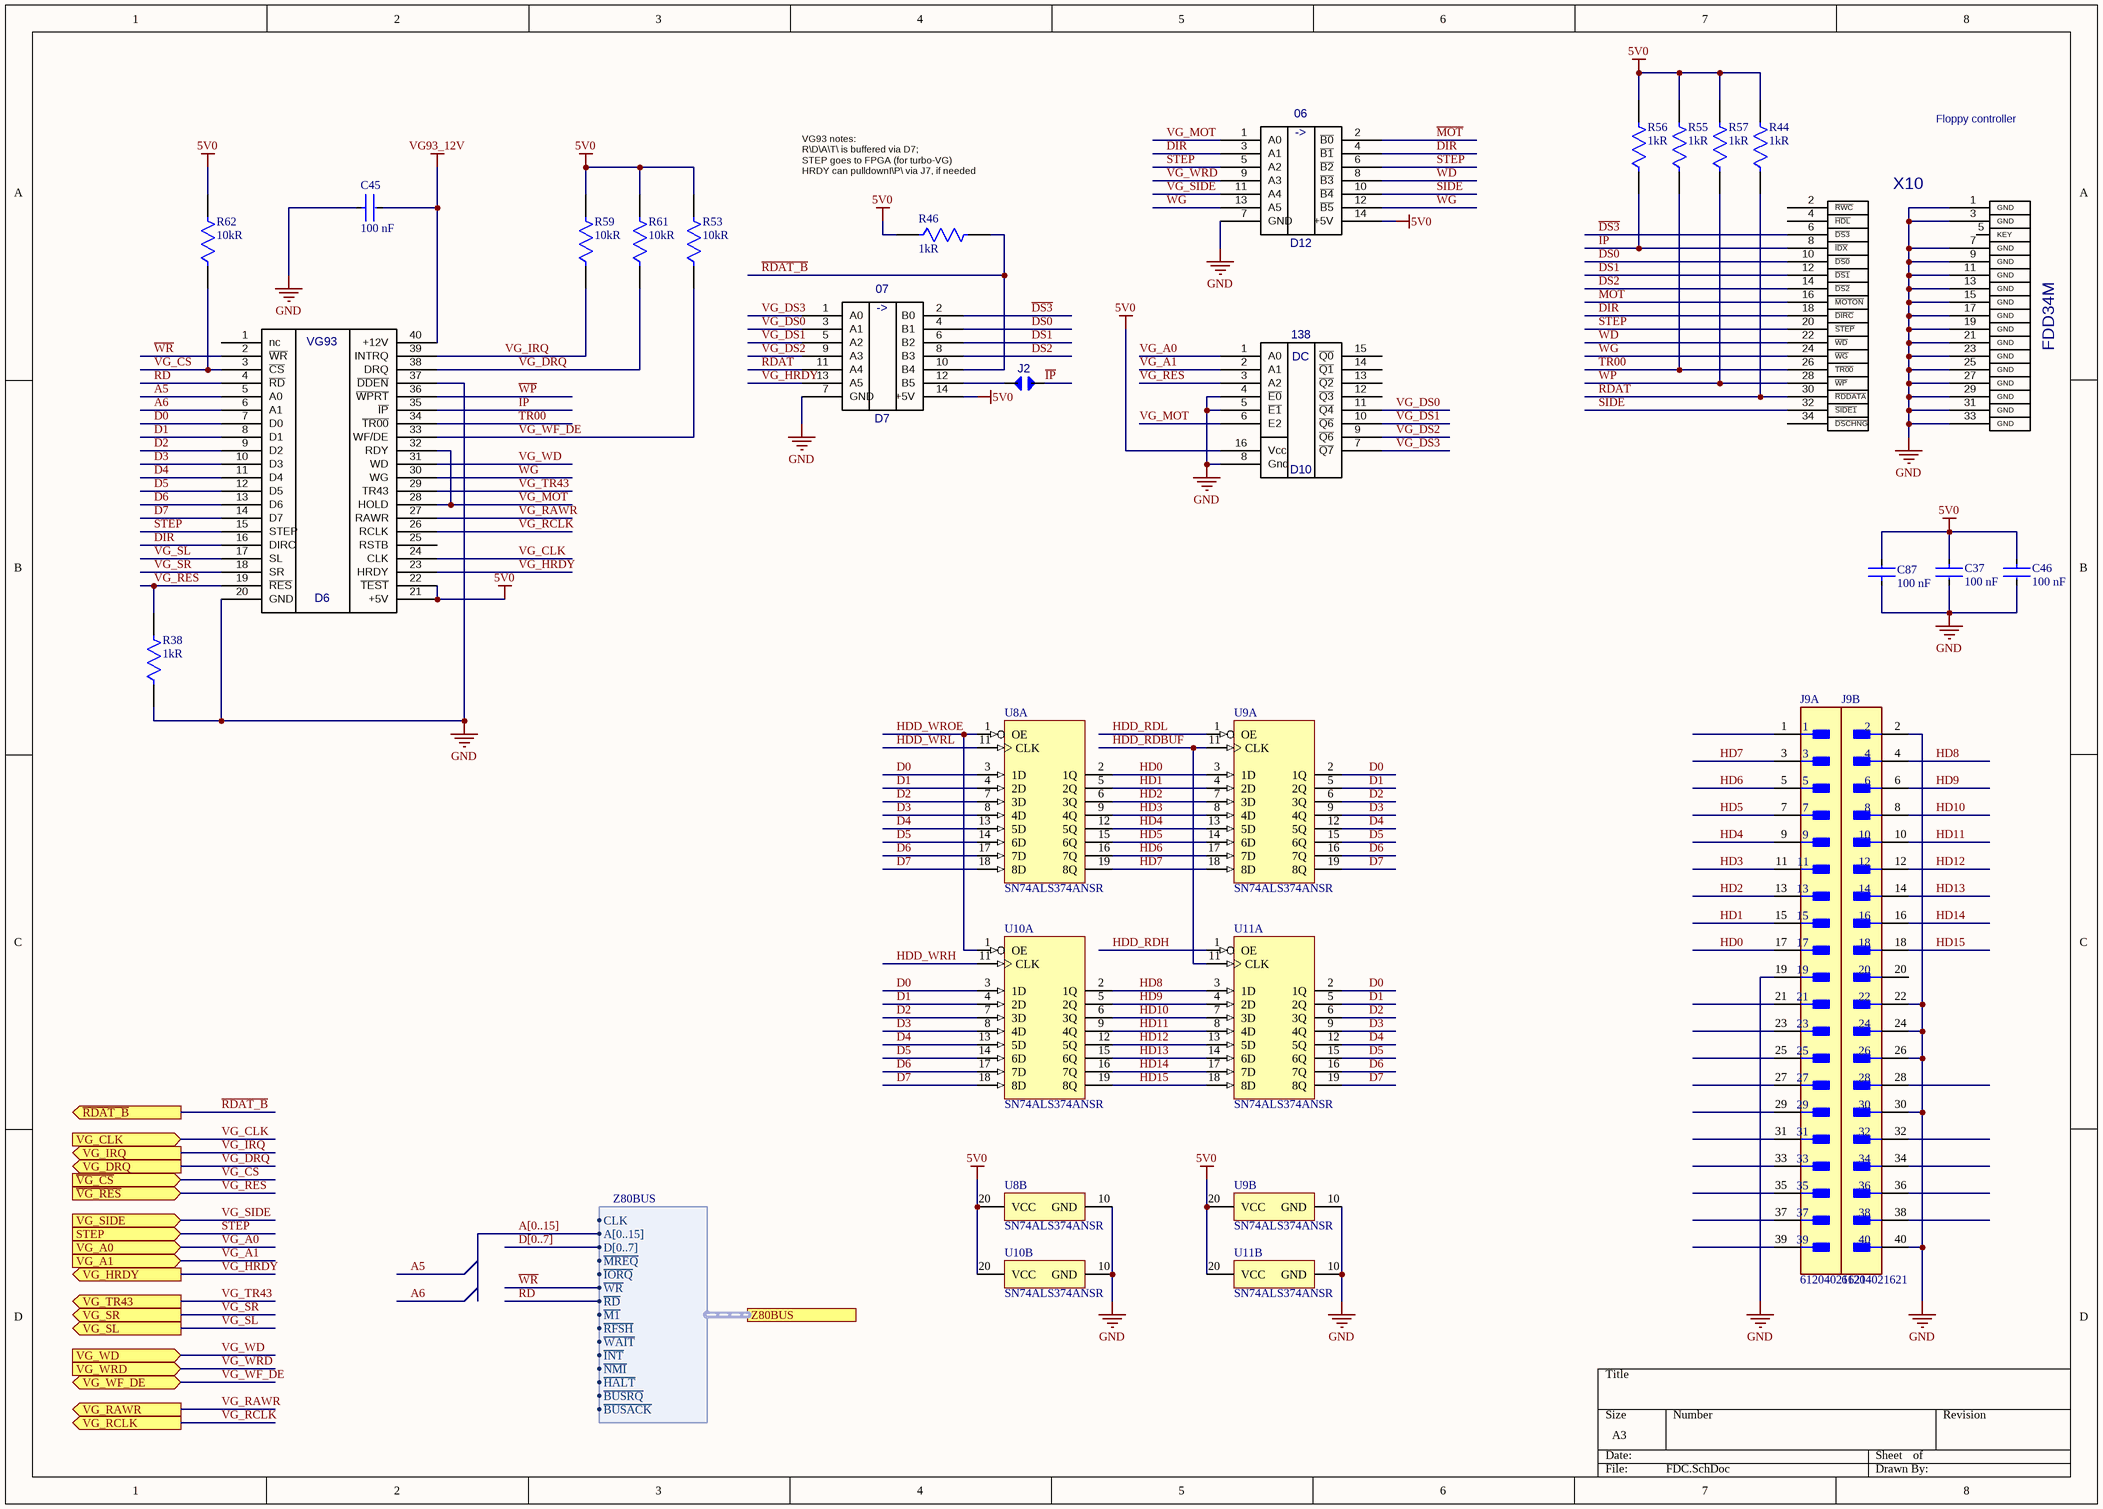
[diagram p4: FDC.SchDoc]

### Parts
C37  Capacitance: 100 nF  [FP-CC0805-0_85-IPC_A]  (hidden comment: CC0805KRX7R9BB104)
C45  Capacitance: 100 nF  [FP-CC0805-0_85-IPC_A]  (hidden comment: CC0805KRX7R9BB104)
C46  Capacitance: 100 nF  [FP-CC0805-0_85-IPC_A]  (hidden comment: CC0805KRX7R9BB104)
C87  Capacitance: 100 nF  [FP-CC0805-0_85-IPC_A]  (hidden comment: CC0805KRX7R9BB104)
D6  KR1818VG93  [DIP40]  (value not drawn)
D7  07  [SO14]
D10  138  [SO16]
D12  06  [SO14]
J2  JUMPER  [JUMPER_JUMPER(Primary)]  (value not drawn)
J9  61204021621  [FP-61204021621-MFG]  (parts A,B of 2)
R38  Resistance: 1kR  [FP-CRCW0805-HPe3-IPC_A]  (hidden comment: CRCW08051K00FKEAHP)
R44  Resistance: 1kR  [FP-CRCW0805-HPe3-IPC_A]  (hidden comment: CRCW08051K00FKEAHP)
R46  Resistance: 1kR  [FP-CRCW0805-HPe3-IPC_A]  (hidden comment: CRCW08051K00FKEAHP)
R53  Resistance: 10kR  [FP-CR0805-IPC_A]  (hidden comment: CR0805-JW-103ELF)
R55  Resistance: 1kR  [FP-CRCW0805-HPe3-IPC_A]  (hidden comment: CRCW08051K00FKEAHP)
R56  Resistance: 1kR  [FP-CRCW0805-HPe3-IPC_A]  (hidden comment: CRCW08051K00FKEAHP)
R57  Resistance: 1kR  [FP-CRCW0805-HPe3-IPC_A]  (hidden comment: CRCW08051K00FKEAHP)
R59  Resistance: 10kR  [FP-CR0805-IPC_A]  (hidden comment: CR0805-JW-103ELF)
R61  Resistance: 10kR  [FP-CR0805-IPC_A]  (hidden comment: CR0805-JW-103ELF)
R62  Resistance: 10kR  [FP-CR0805-IPC_A]  (hidden comment: CR0805-JW-103ELF)
U8  SN74ALS374ANSR  [NS0020A_M]  (parts A,B of 2)
U9  SN74ALS374ANSR  [NS0020A_M]  (parts A,B of 2)
U10  SN74ALS374ANSR  [NS0020A_M]  (parts A,B of 2)
U11  SN74ALS374ANSR  [NS0020A_M]  (parts A,B of 2)
X10  FDD34M  [FDD34M]

### Ports
STEP (in), VG_A0 (in), VG_A1 (in), VG_CLK (in), VG_DRQ (out), VG_HRDY (out), VG_IRQ (out), VG_RAWR (out), VG_RCLK (out), VG_SIDE (in), VG_SL (out), VG_SR (out), VG_TR43 (out), VG_WD (in), VG_WF_DE (bidir), VG_WRD (in), Z80BUS (harness Z80BUS), ~{RDAT_B} (out), ~{VG_CS} (in), ~{VG_RES} (in)

### Harnesses
Z80BUS: A[0..15], D[0..7], ~{MREQ}, ~{IORQ}, ~{WR}, ~{RD}, ~{M1}, ~{RFSH}, ~{WAIT}, ~{INT}, ~{NMI}, ~{HALT}, ~{BUSRQ}, ~{BUSACK}, CLK

### Nets
5V0: C37.1 C46.1 C87.2 D6.21(+5V) D6.22(~{TEST}) D7.14(+5V) D10.16(Vcc) D12.14(+5V) R44.2 R46.1 R53.2 R55.2 R56.2 R57.2 R59.2 R61.2 R62.2 U8.20(VCC) U9.20(VCC) U10.20(VCC) U11.20(VCC)
GND: C37.2 C45.1 C46.2 C87.1 D6.20(GND) D6.37(~{DDEN}) D7.7(GND) D10.4(~{E0}) D10.5(~{E1}) D10.8(Gnd) D12.7(GND) J9.2 J9.19 J9.22 J9.24 J9.26 J9.30 J9.40 R38.1 U8.10(GND) U9.10(GND) U10.10(GND) U11.10(GND) X10.1(GND) X10.3(GND) X10.7(GND) X10.9(GND) X10.11(GND) X10.13(GND) X10.15(GND) X10.17(GND) X10.19(GND) X10.21(GND) X10.23(GND) X10.25(GND) X10.27(GND) X10.29(GND) X10.31(GND) X10.33(GND)
VG93_12V: C45.2 D6.40(+12V)
A5: D6.5(A0)
A6: D6.6(A1)
D0: D6.7(D0) U8.3(1D) U9.2(1Q) U10.3(1D) U11.2(1Q)
D1: D6.8(D1) U8.4(2D) U9.5(2Q) U10.4(2D) U11.5(2Q)
D2: D6.9(D2) U8.7(3D) U9.6(3Q) U10.7(3D) U11.6(3Q)
D3: D6.10(D3) U8.8(4D) U9.9(4Q) U10.8(4D) U11.9(4Q)
D4: D6.11(D4) U8.13(5D) U9.12(5Q) U10.13(5D) U11.12(5Q)
D5: D6.12(D5) U8.14(6D) U9.15(6Q) U10.14(6D) U11.15(6Q)
D6: D6.13(D6) U8.17(7D) U9.16(7Q) U10.17(7D) U11.16(7Q)
D7: D6.14(D7) U8.18(8D) U9.19(8Q) U10.18(8D) U11.19(8Q)
~{DIR}: D12.4(~{B1}) X10.18(~{DIRC})  [project net ~{DIR}_5]
~{DS0}: D7.4(B1) X10.10(~{DS0})  [project net ~{DS0}_5]
~{DS1}: D7.6(B2) X10.12(~{DS1})  [project net ~{DS1}_5]
~{DS2}: D7.8(B3) X10.14(~{DS2})  [project net ~{DS2}_5]
~{DS3}: D7.2(B0) X10.6(~{DS3})  [project net ~{DS3}_5]
DIR: D6.16(DIRC) D12.3(A1)  [project net DIR_5]
HD0: J9.17 U8.2(1Q) U9.3(1D)  [project net HD0_5]
HD1: J9.15 U8.5(2Q) U9.4(2D)  [project net HD1_5]
HD2: J9.13 U8.6(3Q) U9.7(3D)  [project net HD2_5]
HD3: J9.11 U8.9(4Q) U9.8(4D)  [project net HD3_5]
HD4: J9.9 U8.12(5Q) U9.13(5D)  [project net HD4_5]
HD5: J9.7 U8.15(6Q) U9.14(6D)  [project net HD5_5]
HD6: J9.5 U8.16(7Q) U9.17(7D)  [project net HD6_5]
HD7: J9.3 U8.19(8Q) U9.18(8D)  [project net HD7_5]
HD8: J9.4 U10.2(1Q) U11.3(1D)  [project net HD8_5]
HD9: J9.6 U10.5(2Q) U11.4(2D)  [project net HD9_5]
HD10: J9.8 U10.6(3Q) U11.7(3D)  [project net HD10_5]
HD11: J9.10 U10.9(4Q) U11.8(4D)  [project net HD11_5]
HD12: J9.12 U10.12(5Q) U11.13(5D)  [project net HD12_5]
HD13: J9.14 U10.15(6Q) U11.14(6D)  [project net HD13_5]
HD14: J9.16 U10.16(7Q) U11.17(7D)  [project net HD14_5]
HD15: J9.18 U10.19(8Q) U11.18(8D)  [project net HD15_5]
HDD_RDBUF: U9.11(CLK) U11.11(CLK)  [project net HDD_RDBUF_5]
HDD_RDH: U11.1(OE)  [project net HDD_RDH_5]
HDD_RDL: U9.1(OE)  [project net HDD_RDL_5]
HDD_WRH: U10.11(CLK)  [project net HDD_WRH_5]
HDD_WRL: U8.11(CLK)  [project net HDD_WRL_5]
HDD_WROE: U8.1(OE) U10.1(OE)  [project net HDD_WROE_5]
~{IP}: D6.35(~{IP}) J2.1 R56.1 X10.8(~{IDX})  [project net ~{IP}_5]
~{MOT}: D12.2(~{B0}) X10.16(~{MOTON})  [project net ~{MOT}_5]
~{RD}: D6.4(~{RD}) ; port Z80BUS.~{RD}
~{RDAT}: D7.11(A4) R44.1 X10.30(~{RDDATA})  [project net ~{RDAT}_5]
~{RDAT_B}: D7.10(B4) R46.2 ; port ~{RDAT_B}
~{SIDE}: D12.10(~{B4}) X10.32(~{SIDE1})  [project net ~{SIDE}_5]
~{STEP}: D12.6(~{B2}) X10.20(~{STEP})  [project net ~{STEP}_5]
STEP: D6.15(STEP) D12.5(A2) ; port STEP
~{TR00}: D6.34(~{TR00}) R55.1 X10.26(~{TR00})  [project net ~{TR00}_5]
~{VG_CS}: D6.3(~{CS}) R62.1 ; port ~{VG_CS}
~{VG_RES}: D6.19(~{RES}) D10.3(A2) R38.2 ; port ~{VG_RES}
VG_A0: D10.1(A0) ; port VG_A0
VG_A1: D10.2(A1) ; port VG_A1
VG_CLK: D6.24(CLK) ; port VG_CLK
VG_DRQ: D6.38(DRQ) R61.1 ; port VG_DRQ
VG_DS0: D7.3(A1) D10.11(~{Q4})  [project net VG_DS0_5]
VG_DS1: D7.5(A2) D10.10(~{Q6})  [project net VG_DS1_5]
VG_DS2: D7.9(A3) D10.9(~{Q6})  [project net VG_DS2_5]
VG_DS3: D7.1(A0) D10.7(~{Q7})  [project net VG_DS3_5]
VG_HRDY: D6.23(HRDY) D7.13(A5) ; port VG_HRDY
VG_IRQ: D6.39(INTRQ) R59.1 ; port VG_IRQ
VG_MOT: D6.28(HOLD) D6.32(RDY) D10.6(E2) D12.1(A0)  [project net VG_MOT_5]
VG_RAWR: D6.27(RAWR) ; port VG_RAWR
VG_RCLK: D6.26(RCLK) ; port VG_RCLK
VG_SIDE: D12.11(A4) ; port VG_SIDE
VG_SL: D6.17(SL) ; port VG_SL
VG_SR: D6.18(SR) ; port VG_SR
VG_TR43: D6.29(TR43) ; port VG_TR43
VG_WD: D6.31(WD) ; port VG_WD
VG_WF_DE: D6.33(WF/DE) R53.1 ; port VG_WF_DE
VG_WRD: D12.9(A3) ; port VG_WRD
~{WD}: D12.8(~{B3}) X10.22(~{WD})  [project net ~{WD}_5]
~{WG}: D12.12(~{B5}) X10.24(~{WG})  [project net ~{WG}_5]
~{WP}: D6.36(~{WPRT}) R57.1 X10.28(~{WP})  [project net ~{WP}_5]
~{WR}: D6.2(~{WR}) ; port Z80BUS.~{WR}
WG: D6.30(WG) D12.13(A5)  [project net WG_5]
NetD7_12: D7.12(B5) J2.0

Not connected (* = marked no-connect by the designer): D6 1(nc) 25(RSTB); D10 12(~{Q3}) 13(~{Q2}) 14(~{Q1}) 15(~{Q0}); J9 1 20 21 23 25 27 28 29 31 32 33 34 35 36 37 38 39; X10 2(~{RWC}) 4(~{HDL}) 5(KEY) 34(~{DSCHNG})

### Buses and harness runs
bus A[0..15]
bus D[0..7]

### Notes on the sheet
- Floppy controller
- (near R46) VG93 notes:
  R\D\A\T\ is buffered via D7;
  STEP goes to FPGA (for turbo-VG)
  HRDY can pulldownI\P\ via J7, if needed
- (in symbol 06) ->
- (in symbol 07) ->
- (in symbol 138) DC
- (in symbol KR1818VG93) VG93

### Library data of the parts
C37 C45 C46 C87 = CMP-2100-03606-3: as C106 on sheet FPGA; Manufacturer Part Number: CC0805KRX7R9BB104; Category: Cap; Case/Package: 0805
D7 = 07: Value: 74HCT07; Case/Package: SOIC-14; Category: IC
D10 = 138: value: 74HCT138; Case/Package: SOIC-16; Category: IC
D12 = 06: Value: 74HCT06; Case/Package: SOIC-14; Category: IC
J2 = JUMPER: HLT->~IP; Value: PLS-2; Case/Package: PLS-2; Category: Connector
J9 = CMP-1502-00015-2: CONN HEADER VERT 40POS 2.54MM; Gender: Male; Pitch: 0.1inch; Number of Contacts: 40; Voltage Rating: 250V; Packaging: Tray; Contact Shape: Square; Termination: Solder; Contact Finish - Mating: GOLD; Number of Rows: 2; Mount: Through Hole; Fastening Type: Pull; Contact Type: Male Pin; Min Operating Temperature: -40°C; Contact Material: Copper Alloy; RoHS Compliant: Yes; Max Operating Temperature: 125°C; Color: Black; Insulation Color: Black; Flammability Rating: UL94 V-0; Insulation Material: PBT; Number of Positions: 40; Connector Type: Header; Contact Plating: Gold; Series: WR-BHD; Row Spacing: 0.1inch
R38 R44 R46 R55-R57 = CMP-02407-004529-1: as R19 on sheet FPGA; Case/Package: 0805; Number of Pins: 2; Termination: Solder; Manufacturer Part Number: CRCW08051K00FKEAHP; value: 1kΩ; Category: Res
R53 R59 R61 R62 = CMP-07231-003873-1: as R20 on sheet FPGA; value: 10kΩ; Manufacturer Part Number: CR0805-JW-103ELF; Number of Terminations: 2; Termination: SMD/SMT; Number of Pins: 2; Case/Package: 0805; Category: Res
U8-U11 = CMP-1619-00865-2: Octal D-Type Edge Triggered Flip-Flops with 3-State Outputs, NS0020A, LARGE T&R; Manufacturer: Texas Instruments; Voltage(Nom)(V): 5; Output Drive (IOL/IOH)(Max)(mA): 24/-2.6; F @ Nom Voltage(Max)(Mhz): 75; VCC(Min)(V): 4.5; VCC(Max)(V): 5.5; Input Type: TTL; Bits(#): 8; 3-State Output: Yes; Schmitt Trigger: No; tpd @ Nom Voltage(Max)(ns): 16; ICC @ Nom Voltage(Max)(mA): 31; Technology Family: ALS; Output Logic: Non-inverted; Rating: Catalog; Generic Part Number: SN74ALS374A; Operating Temperature Range(C): 0 to 70; DatasheetVersion: SDAS167C; PackageReference: NS0020A; Output Type: TTL
X10 = FDD34M: Value: Shrouded Header 34 pos 2.54mm 2 row; Case/Package: IDC-34; Category: Connector
D6 = KR1818VG93: Value: KR1818VG93; Case/Package: DIP-40; Category: IC

## Sheet CPLD.SchDoc
size A3; SheetNumber: 12; SheetTotal: 15
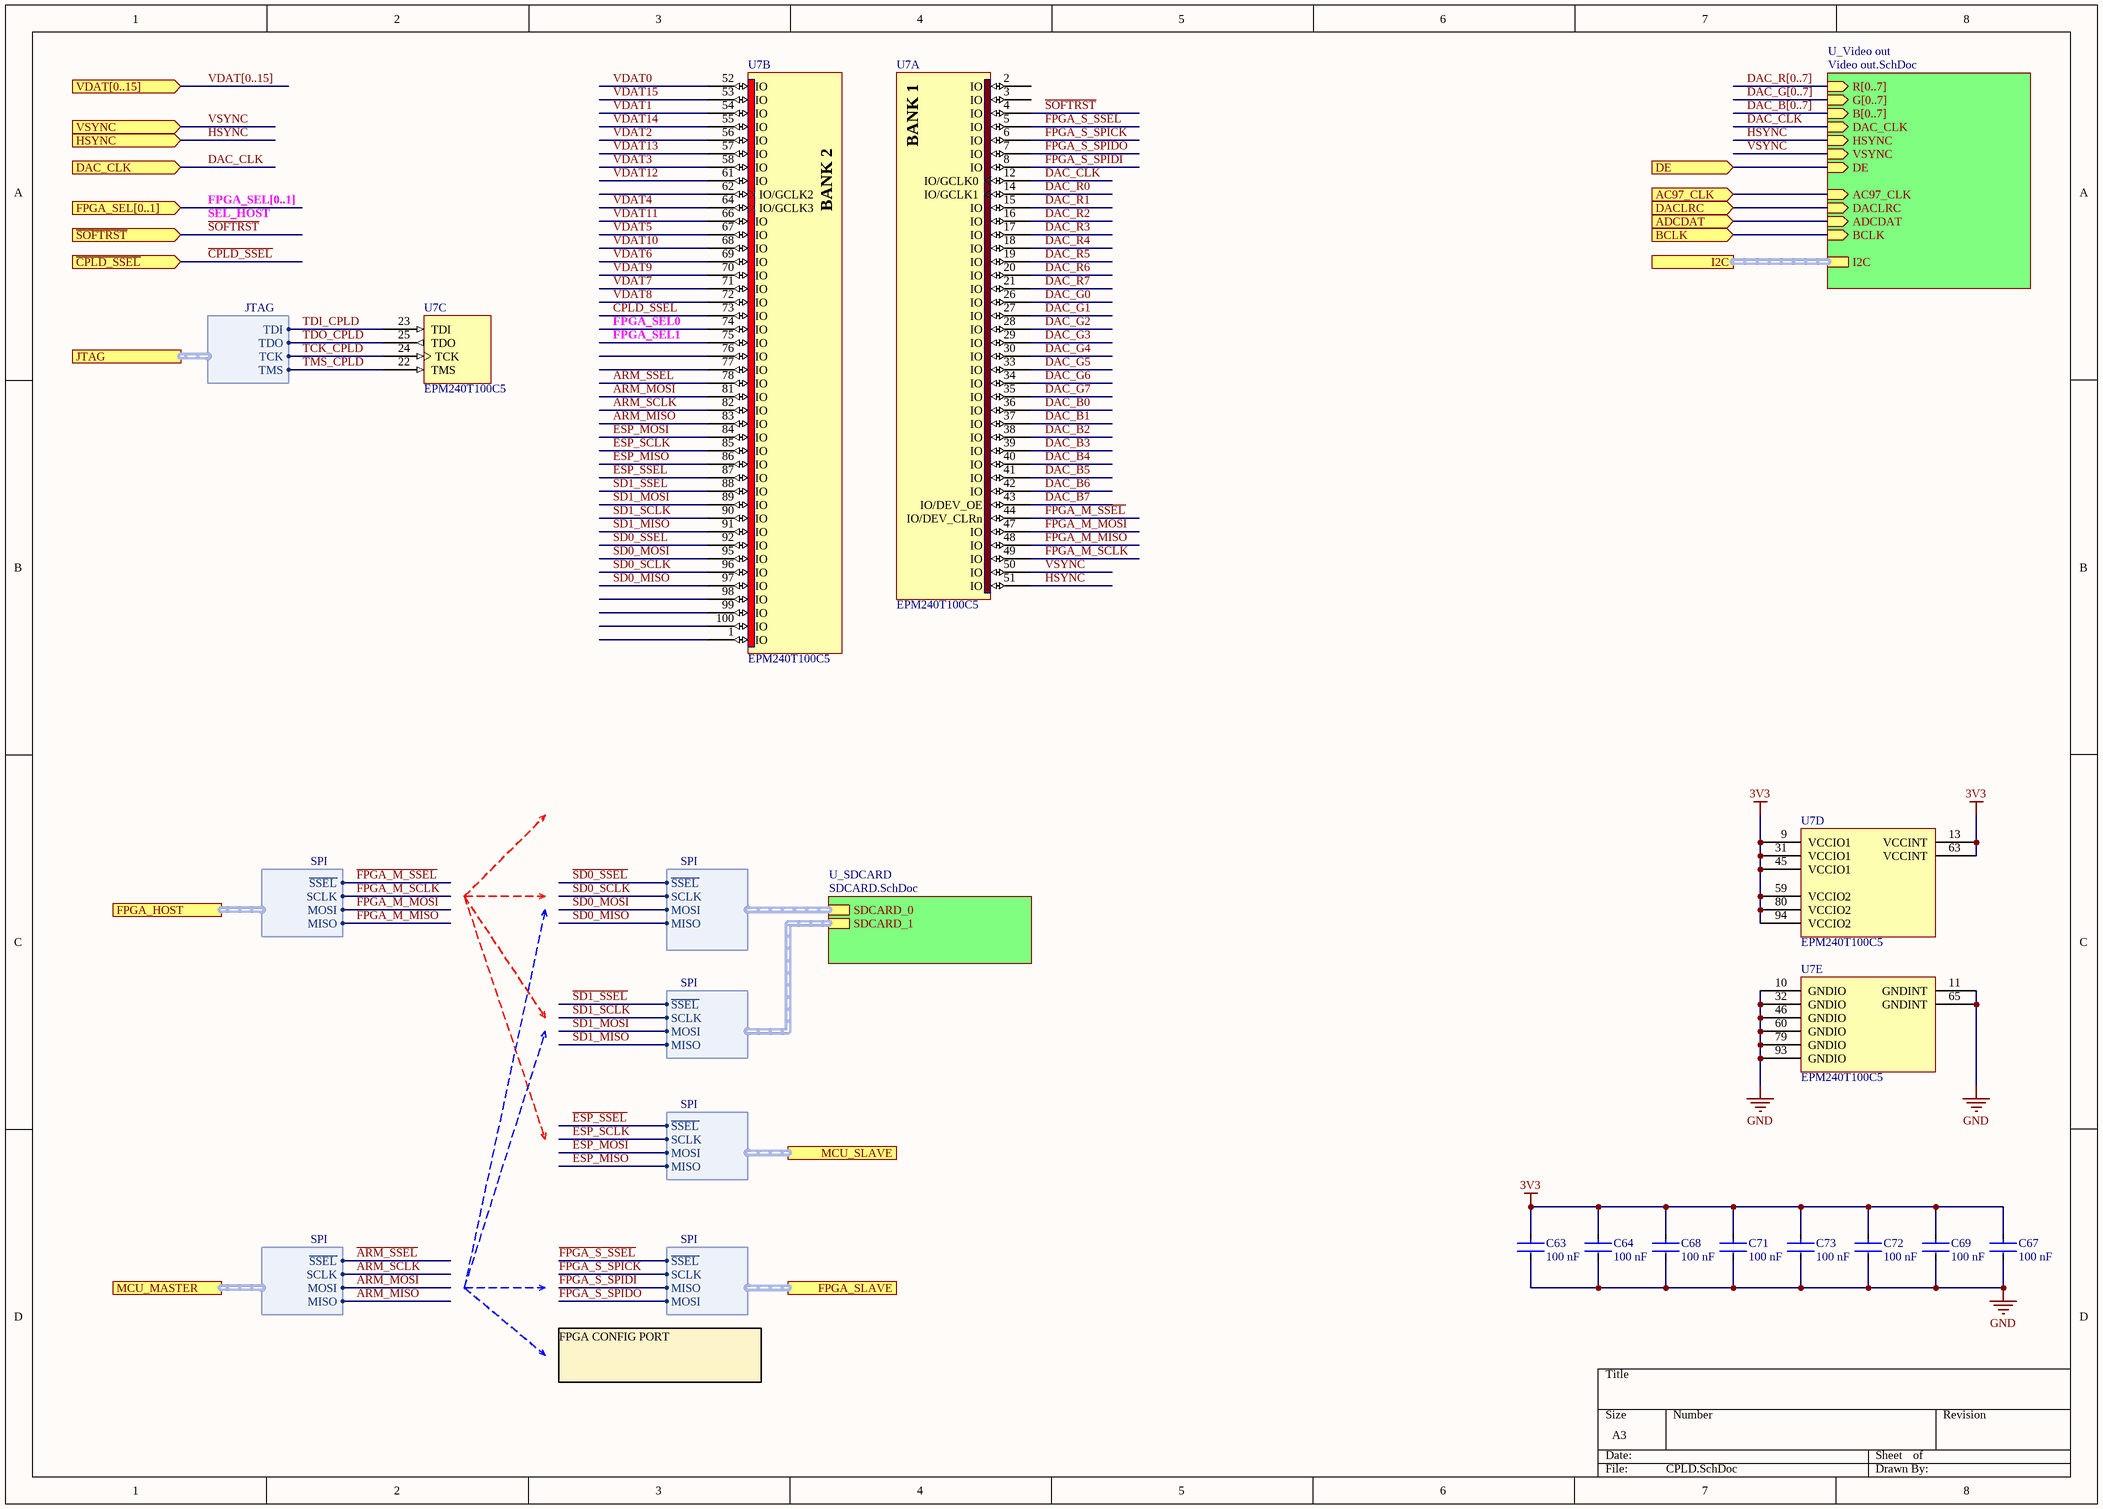
[diagram p5: CPLD.SchDoc]

### Parts
C63  Capacitance: 100 nF  [FP-CC0805-0_85-IPC_A]  (hidden comment: CC0805KRX7R9BB104)
C64  Capacitance: 100 nF  [FP-CC0805-0_85-IPC_A]  (hidden comment: CC0805KRX7R9BB104)
C67  Capacitance: 100 nF  [FP-CC0805-0_85-IPC_A]  (hidden comment: CC0805KRX7R9BB104)
C68  Capacitance: 100 nF  [FP-CC0805-0_85-IPC_A]  (hidden comment: CC0805KRX7R9BB104)
C69  Capacitance: 100 nF  [FP-CC0805-0_85-IPC_A]  (hidden comment: CC0805KRX7R9BB104)
C71  Capacitance: 100 nF  [FP-CC0805-0_85-IPC_A]  (hidden comment: CC0805KRX7R9BB104)
C72  Capacitance: 100 nF  [FP-CC0805-0_85-IPC_A]  (hidden comment: CC0805KRX7R9BB104)
C73  Capacitance: 100 nF  [FP-CC0805-0_85-IPC_A]  (hidden comment: CC0805KRX7R9BB104)
U7  EPM240T100C5  [TQFP100_M]  (parts A,B,C,D,E of 5)

### Sub-sheets
U_SDCARD = SDCARD.SchDoc: SDCARD_0 (harness SPI), SDCARD_1 (harness SPI)
U_Video out = Video out.SchDoc: R[0..7] (in), G[0..7] (in), B[0..7] (in), DAC_CLK (in), HSYNC (in), VSYNC (in), AC97_CLK (in), DACLRC (in), ADCDAT (in), BCLK (in), DE (in), I2C (harness I2C)

### Ports
AC97_CLK (in), ADCDAT (in), BCLK (in), DAC_CLK (in), DACLRC (in), DE (in), FPGA_HOST (harness SPI), FPGA_SEL[0..1] (in), FPGA_SLAVE (harness SPI), HSYNC (in), I2C (harness I2C), JTAG (harness JTAG), MCU_MASTER (harness SPI), MCU_SLAVE (harness SPI), VDAT[0..15] (in), VSYNC (in), ~{CPLD_SSEL} (in), ~{SOFTRST} (in)

### Harnesses
SPI: ~{SSEL}, SCLK, MOSI, MISO
JTAG: TCK, TDO, TDI, TMS

### Nets
3V3: C63.1 C64.1 C67.1 C68.1 C69.1 C71.1 C72.1 C73.1 U7.9(VCCIO1) U7.13(VCCINT) U7.31(VCCIO1) U7.45(VCCIO1) U7.59(VCCIO2) U7.63(VCCINT) U7.80(VCCIO2) U7.94(VCCIO2)
GND: C63.2 C64.2 C67.2 C68.2 C69.2 C71.2 C72.2 C73.2 U7.10(GNDIO) U7.11(GNDINT) U7.32(GNDIO) U7.46(GNDIO) U7.60(GNDIO) U7.65(GNDINT) U7.79(GNDIO) U7.93(GNDIO)
~{ARM_SSEL}: U7.78(IO) ; port MCU_MASTER.~{SSEL}  [project net ESP32_MASTER.~{SSEL}]
AC97_CLK: port AC97_CLK, sheet U_Video out/AC97_CLK
ADCDAT: port ADCDAT, sheet U_Video out/ADCDAT
ARM_MISO: U7.83(IO) ; port MCU_MASTER.MISO  [project net ESP32_MASTER.MISO]
ARM_MOSI: U7.81(IO) ; port MCU_MASTER.MOSI  [project net ESP32_MASTER.MOSI]
ARM_SCLK: U7.82(IO) ; port MCU_MASTER.SCLK  [project net ESP32_MASTER.SCLK]
BCLK: port BCLK, sheet U_Video out/BCLK
~{CPLD_SSEL}: U7.73(IO) ; port ~{CPLD_SSEL}
DAC_B0: U7.36(IO)  [project net DAC_B0_12]
DAC_B1: U7.37(IO)  [project net DAC_B1_12]
DAC_B2: U7.38(IO)  [project net DAC_B2_12]
DAC_B3: U7.39(IO)  [project net DAC_B3_12]
DAC_B4: U7.40(IO)  [project net DAC_B4_12]
DAC_B5: U7.41(IO)  [project net DAC_B5_12]
DAC_B6: U7.42(IO)  [project net DAC_B6_12]
DAC_B7: U7.43(IO/DEV_OE)  [project net DAC_B7_12]
DAC_CLK: U7.12(IO/GCLK0) ; port DAC_CLK, sheet U_Video out/DAC_CLK
DAC_G0: U7.26(IO)  [project net DAC_G0_12]
DAC_G1: U7.27(IO)  [project net DAC_G1_12]
DAC_G2: U7.28(IO)  [project net DAC_G2_12]
DAC_G3: U7.29(IO)  [project net DAC_G3_12]
DAC_G4: U7.30(IO)  [project net DAC_G4_12]
DAC_G5: U7.33(IO)  [project net DAC_G5_12]
DAC_G6: U7.34(IO)  [project net DAC_G6_12]
DAC_G7: U7.35(IO)  [project net DAC_G7_12]
DAC_R0: U7.14(IO/GCLK1)  [project net DAC_R0_12]
DAC_R1: U7.15(IO)  [project net DAC_R1_12]
DAC_R2: U7.16(IO)  [project net DAC_R2_12]
DAC_R3: U7.17(IO)  [project net DAC_R3_12]
DAC_R4: U7.18(IO)  [project net DAC_R4_12]
DAC_R5: U7.19(IO)  [project net DAC_R5_12]
DAC_R6: U7.20(IO)  [project net DAC_R6_12]
DAC_R7: U7.21(IO)  [project net DAC_R7_12]
DACLRC: port DACLRC, sheet U_Video out/DACLRC
DE: port DE, sheet U_Video out/DE
~{ESP_SSEL}: U7.87(IO) ; port MCU_SLAVE.~{SSEL}  [project net ESP32_SLAVE.~{SSEL}]
ESP_MISO: U7.86(IO) ; port MCU_SLAVE.MISO  [project net ESP32_SLAVE.MISO]
ESP_MOSI: U7.84(IO) ; port MCU_SLAVE.MOSI  [project net ESP32_SLAVE.MOSI]
ESP_SCLK: U7.85(IO) ; port MCU_SLAVE.SCLK  [project net ESP32_SLAVE.SCLK]
~{FPGA_M_}~{SSEL}: U7.44(IO/DEV_CLRn) ; port FPGA_HOST.~{SSEL}  [project net SPI_HOST.~{SSEL}]
~{FPGA_S_SSEL}: U7.5(IO) ; port FPGA_SLAVE.~{SSEL}  [project net ~{SPI_SLAVE_SSEL}]
FPGA_M_MISO: U7.48(IO) ; port FPGA_HOST.MISO  [project net SPI_HOST.MISO]
FPGA_M_MOSI: U7.47(IO) ; port FPGA_HOST.MOSI  [project net SPI_HOST.MOSI]
FPGA_M_SCLK: U7.49(IO) ; port FPGA_HOST.SCLK  [project net SPI_HOST.SCLK]
FPGA_S_SPICK: U7.6(IO) ; port FPGA_SLAVE.SCLK  [project net SPI_SLAVE.SCLK]
FPGA_S_SPIDI: U7.8(IO) ; port FPGA_SLAVE.MISO  [project net SPI_SLAVE.MISO]
FPGA_S_SPIDO: U7.7(IO) ; port FPGA_SLAVE.MOSI  [project net SPI_SLAVE.MOSI]
FPGA_SEL0: U7.74(IO)
FPGA_SEL1: U7.75(IO)
HSYNC: U7.51(IO) ; port HSYNC, sheet U_Video out/HSYNC
~{SD0_SSEL}: U7.92(IO) ; sheet U_SDCARD/SDCARD_0.~{SSEL}
~{SD1_SSEL}: U7.88(IO) ; sheet U_SDCARD/SDCARD_1.~{SSEL}
~{SOFTRST}: U7.4(IO) ; port ~{SOFTRST}
SD0_MISO: U7.97(IO) ; sheet U_SDCARD/SDCARD_0.MISO
SD0_MOSI: U7.95(IO) ; sheet U_SDCARD/SDCARD_0.MOSI
SD0_SCLK: U7.96(IO) ; sheet U_SDCARD/SDCARD_0.SCLK
SD1_MISO: U7.91(IO) ; sheet U_SDCARD/SDCARD_1.MISO
SD1_MOSI: U7.89(IO) ; sheet U_SDCARD/SDCARD_1.MOSI
SD1_SCLK: U7.90(IO) ; sheet U_SDCARD/SDCARD_1.SCLK
TCK_CPLD: U7.24(TCK) ; port JTAG.TCK  [project net TCK_FPGA]
TDI_CPLD: U7.23(TDI) ; port JTAG.TDI  [project net TDO_FPGA]
TDO_CPLD: U7.25(TDO) ; port JTAG.TDO
TMS_CPLD: U7.22(TMS) ; port JTAG.TMS  [project net TMS_FPGA]
VDAT0: U7.52(IO)
VDAT1: U7.54(IO)
VDAT2: U7.56(IO)
VDAT3: U7.58(IO)
VDAT4: U7.64(IO/GCLK3)
VDAT5: U7.67(IO)
VDAT6: U7.69(IO)
VDAT7: U7.71(IO)
VDAT8: U7.72(IO)
VDAT9: U7.70(IO)
VDAT10: U7.68(IO)
VDAT11: U7.66(IO)
VDAT12: U7.61(IO)
VDAT13: U7.57(IO)
VDAT14: U7.55(IO)
VDAT15: U7.53(IO)
VSYNC: U7.50(IO) ; port VSYNC, sheet U_Video out/VSYNC

Not connected (* = marked no-connect by the designer): U7 1(IO) 2(IO) 3(IO) 62(IO/GCLK2) 76(IO) 77(IO) 98(IO) 99(IO) 100(IO)

### Buses and harness runs
bus DAC_B[0..7] = sheet U_Video out/B[0..7]
bus DAC_G[0..7] = sheet U_Video out/G[0..7]
bus DAC_R[0..7] = sheet U_Video out/R[0..7]
bus FPGA_SEL[0..1] = port FPGA_SEL[0..1]
bus VDAT[0..15] = port VDAT[0..15]
harness port I2C = sheet U_Video out/I2C

### Notes on the sheet
- FPGA CONFIG PORT
- Labels drawn without touching a wire or pin: SEL_HOST
- (in symbol CMP-0144-00216-1, part A) BANK 1
- (in symbol CMP-0144-00216-1, part B) BANK 2
- (in symbol EPM240T100C5, part A) BANK 1
- (in symbol EPM240T100C5, part B) BANK 2

### Library data of the parts
C63 C64 C67-C69 C71-C73 = CMP-2100-03606-3: as C106 on sheet FPGA; Category: Cap; Manufacturer Part Number: CC0805KRX7R9BB104; Case/Package: 0805
U7 = CMP-0144-00216-1: MAX II 3.3/2.5V CPLD, 80 IOs, 240 Logic Elements, 100-Pin Plastic TQFP, Commercial Temperature, Speed Grade 5; Manufacturer: Intel Altera; PackageDescription: 100-Pin Plastic Thin Quad Flat Pack (TQFP100) - Wire Bond; Manufacturer Part Number: EPM240T100C5; value: EPM240T100C5; Case/Package: TQFP-100; Category: IC

## Sheet Video out.SchDoc
size A4; SheetNumber: 13; SheetTotal: 15
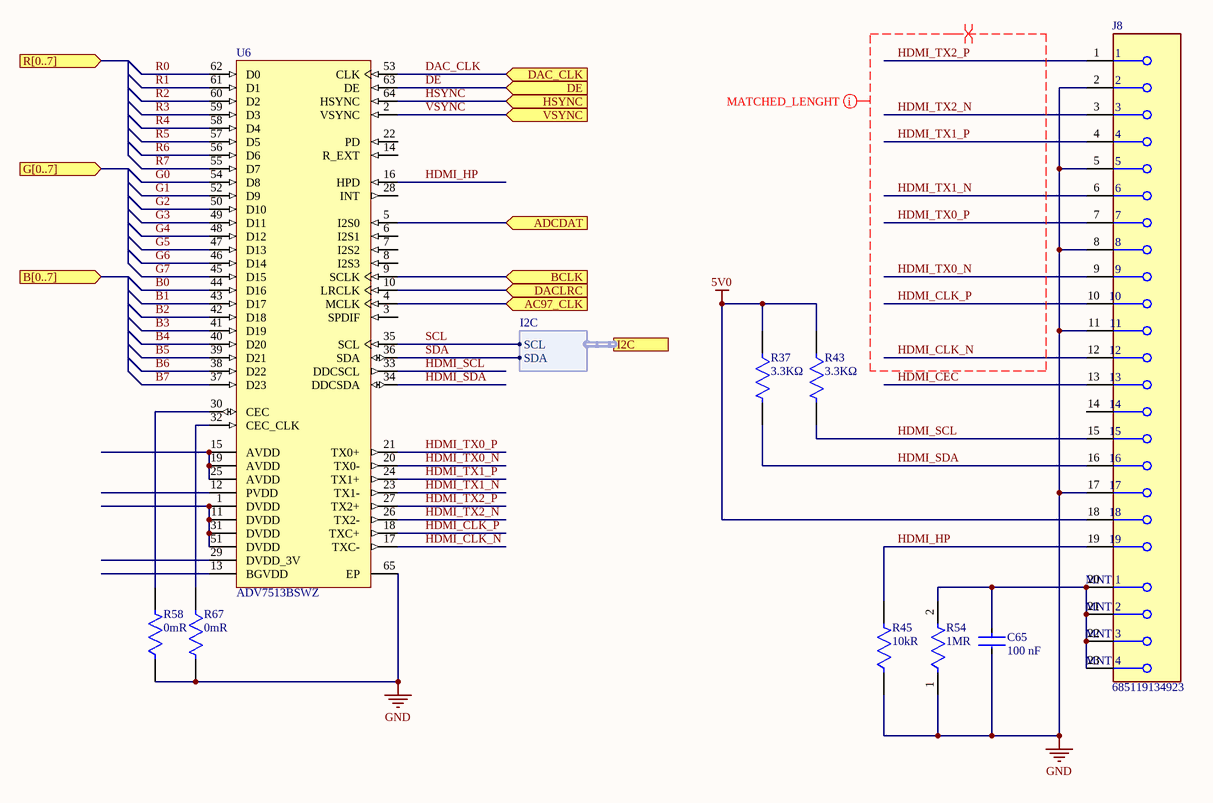
[diagram p6: Video out.SchDoc]

### Parts
C65  Capacitance: 100 nF  [FP-CC0805-0_85-IPC_A]  (hidden comment: CC0805KRX7R9BB104)
J8  685119134923  [FP-685119134923-MFG]
R37  Resistance: 3.3KΩ  [FP-RT0805-IPC_A]  (hidden comment: RT0805FRE073K3L)
R43  Resistance: 3.3KΩ  [FP-RT0805-IPC_A]  (hidden comment: RT0805FRE073K3L)
R45  Resistance: 10kR  [FP-CR0805-IPC_A]  (hidden comment: CR0805-JW-103ELF)
R54  Resistance: 1MR  [FP-ERJ6EN-IPC_A]  (hidden comment: ERJ-6ENF1004V)
R58  Resistance: 0mR  [FP-CR0805-IPC_A]  (hidden comment: CR0805-J/-000ELF)
R67  Resistance: 0mR  [FP-CR0805-IPC_A]  (hidden comment: CR0805-J/-000ELF)
U6  ADV7513BSWZ  [ADI-LQFP-64_M]

### Ports
AC97_CLK (in), ADCDAT (in), B[0..7] (in), BCLK (in), DAC_CLK (in), DACLRC (in), DE (in), G[0..7] (in), HSYNC (in), I2C (harness I2C), R[0..7] (in), VSYNC (in)

### Harnesses
I2C: SDA, SCL

### Nets
5V0: J8.18 R37.1 R43.1
GND: C65.2 J8.2 J8.5 J8.8 J8.11 J8.17 R45.1 R54.1 R58.1 R67.2 U6.65(EP)
AC97_CLK: U6.4(MCLK) ; port AC97_CLK
ADCDAT: U6.5(I2S0) ; port ADCDAT
B0: U6.44(D16)  [project net B0_13]
B1: U6.43(D17)  [project net B1_13]
B2: U6.42(D18)  [project net B2_13]
B3: U6.41(D19)  [project net B3_13]
B4: U6.40(D20)  [project net B4_13]
B5: U6.39(D21)  [project net B5_13]
B6: U6.38(D22)  [project net B6_13]
B7: U6.37(D23)  [project net B7_13]
BCLK: U6.9(SCLK) ; port BCLK
DAC_CLK: U6.53(CLK) ; port DAC_CLK
DACLRC: U6.10(LRCLK) ; port DACLRC
DE: U6.63(DE) ; port DE
G0: U6.54(D8)  [project net G0_13]
G1: U6.52(D9)  [project net G1_13]
G2: U6.50(D10)  [project net G2_13]
G3: U6.49(D11)  [project net G3_13]
G4: U6.48(D12)  [project net G4_13]
G5: U6.47(D13)  [project net G5_13]
G6: U6.46(D14)  [project net G6_13]
G7: U6.45(D15)  [project net G7_13]
HDMI_CEC: J8.13  [project net HDMI_CEC_13]
HDMI_CLK_N: J8.12 U6.17(TXC-)  [project net HDMI_CLK_N_13]
HDMI_CLK_P: J8.10 U6.18(TXC+)  [project net HDMI_CLK_P_13]
HDMI_HP: J8.19 R45.2 U6.16(HPD)  [project net HDMI_HP_13]
HDMI_SCL: J8.15 R43.2 U6.33(DDCSCL)  [project net HDMI_SCL_13]
HDMI_SDA: J8.16 R37.2 U6.34(DDCSDA)  [project net HDMI_SDA_13]
HDMI_TX0_N: J8.9 U6.20(TX0-)  [project net HDMI_TX0_N_13]
HDMI_TX0_P: J8.7 U6.21(TX0+)  [project net HDMI_TX0_P_13]
HDMI_TX1_N: J8.6 U6.23(TX1-)  [project net HDMI_TX1_N_13]
HDMI_TX1_P: J8.4 U6.24(TX1+)  [project net HDMI_TX1_P_13]
HDMI_TX2_N: J8.3 U6.26(TX2-)  [project net HDMI_TX2_N_13]
HDMI_TX2_P: J8.1 U6.27(TX2+)  [project net HDMI_TX2_P_13]
HSYNC: U6.64(HSYNC) ; port HSYNC
R0: U6.62(D0)  [project net R0_13]
R1: U6.61(D1)  [project net R1_13]
R2: U6.60(D2)  [project net R2_13]
R3: U6.59(D3)  [project net R3_13]
R4: U6.58(D4)  [project net R4_13]
R5: U6.57(D5)  [project net R5_13]
R6: U6.56(D6)  [project net R6_13]
R7: U6.55(D7)  [project net R7_13]
SCL: U6.35(SCL) ; port I2C.SCL  [project net I2C.SCL]
SDA: U6.36(SDA) ; port I2C.SDA  [project net I2C.SDA]
VSYNC: U6.2(VSYNC) ; port VSYNC
NetC65_1: C65.1 J8.20(MNT_1) J8.21(MNT_2) J8.22(MNT_3) J8.23(MNT_4) R54.2
NetR58_2: R58.2 U6.30(CEC)
NetR67_1: R67.1 U6.32(CEC_CLK)
NetU6_1: U6.1(DVDD) U6.11(DVDD) U6.31(DVDD) U6.51(DVDD)
NetU6_15: U6.15(AVDD) U6.19(AVDD) U6.25(AVDD)

Not connected (* = marked no-connect by the designer): J8 14; U6 3(SPDIF) 6(I2S1) 7(I2S2) 8(I2S3) 12(PVDD) 13(BGVDD) 14(R_EXT) 22(PD) 28(INT) 29(DVDD_3V)

### Layout directives
differential pair: HDMI_CLK_N, HDMI_CLK_P, HDMI_TX0_N, HDMI_TX0_P, HDMI_TX1_N, HDMI_TX1_P, HDMI_TX2_N, HDMI_TX2_P
rule Matched Net Lengths [Tolerance = 10mil]; rule Matched Net Lengths [Tolerance = 5mil]: HDMI_CLK_N, HDMI_CLK_P, HDMI_TX0_N, HDMI_TX0_P, HDMI_TX1_N, HDMI_TX1_P, HDMI_TX2_N, HDMI_TX2_P

### Library data of the parts
C65 = CMP-2100-03606-3: as C106 on sheet FPGA; Manufacturer Part Number: CC0805KRX7R9BB104; Category: Cap; Case/Package: 0805
J8 = CMP-1502-00169-2: CONN RCPT HDMI 19POS SMD R/A; Number of Positions: 19; Body Material: Plastic; Number of Ports: 1; Gender: Receptacle; Shielding: Shielded; Min Operating Temperature: -25°C; Packaging: Tape and Reel; Width: 15mm; Length: 12.15mm; Insulation Color: Black; Connector Type: HDMI; Series: WR-COM; Max Operating Temperature: 85°C; RoHS Compliant: Yes; Mount: Surface Mount; Height: 5.55mm; Features: Shielded; Number of Contacts: 19; Package Quantity: 1; Orientation: Right Angle; Contact Material: Bronze; Termination: SMD/SMT; Color: Black; Flammability Rating: UL94 V-0
R37 R43 = CMP-03412-025935-1: RES SMD 3.3K OHM 1% 1/8W 0805; Manufacturer: Yageo; Value: 3.3KΩ; Manufacturer Part Number: RT0805FRE073K3L; Category: Res; Case/Package: 0805
R45 = CMP-07231-003873-1: as R20 on sheet FPGA; value: 10kΩ; Manufacturer Part Number: CR0805-JW-103ELF; Number of Terminations: 2; Termination: SMD/SMT; Number of Pins: 2; Case/Package: 0805; Category: Res
R54 = CMP-2001-04378-6: RES SMD 1M OHM 1% 1/8W 0805; Temperature Coefficient: 100ppm/°C; Power Rating: 125mW; Voltage Rating: 150V; Length: 2mm; Height: 0.6mm; Technology: THICK FILM; Max Operating Temperature: 155°C; Case Code (Metric): 2012; Number of Terminations: 2; Radiation Hardening: No; Package Quantity: 1; Case Code (Imperial): 0805; Tolerance: 1%; RoHS Compliant: Yes; Contact Plating: Tin; Case/Package: 0805; Max Power Dissipation: 125mW; REACH SVHC: No SVHC; Lead Free: Lead Free; Termination: SMD/SMT; Size Code: 0805; Resistance Tolerance: 1%; Construction: Rectangular; Series: ERJ; Resistor Type: Thick Film; Depth: 1.25mm; Packaging: Tape and Reel; Min Operating Temperature: -55°C; Mount: Surface Mount; Features: Automotive AEC-Q200; Voltage Rating (DC): 150V; Military Standard: Not; Width: 1.2mm; Number of Pins: 2
R58 R67 = CMP-07231-004348-1: as R108 on sheet FPGA; Case/Package: 0805; Number of Pins: 2; Termination: SMD/SMT; Manufacturer Part Number: CR0805-J/-000ELF; value: 0Ω; Category: Res
U6 = CMP-2000-05043-1: High Performance HDMI Transmitter, 165 MHz, 1.8 to 3.3 V, -25 to 85 degC, 64-Pin LQFP, RoHS, Tray; Manufacturer: AnalogDevicesInc.; Operating Supply Voltage: 1.8Vto3.3V; Brand: AnalogDevices; Number of Channels: 8Channel; Datasheet Version: Rev. A, 01/2013; Manufacturer URL: http://www.analog.com/; Type: HDMITransmitters; Product Category: VideoICs; Minimum Operating Temperature: -25C; Series: ADV7513; Mounting Style: SMD/SMT; Package / Case: LQFP-64; Maximum Operating Temperature: +85C; Datasheet URL: https://datasheet.ciiva.com/15120/getdatasheetpartid-570006-15120176.pdf; Factory Pack Quantity: 160; RoHS: Details; Packaging: Tray